# EAGLE design BIBOX Tern  (EAGLE 6.4)
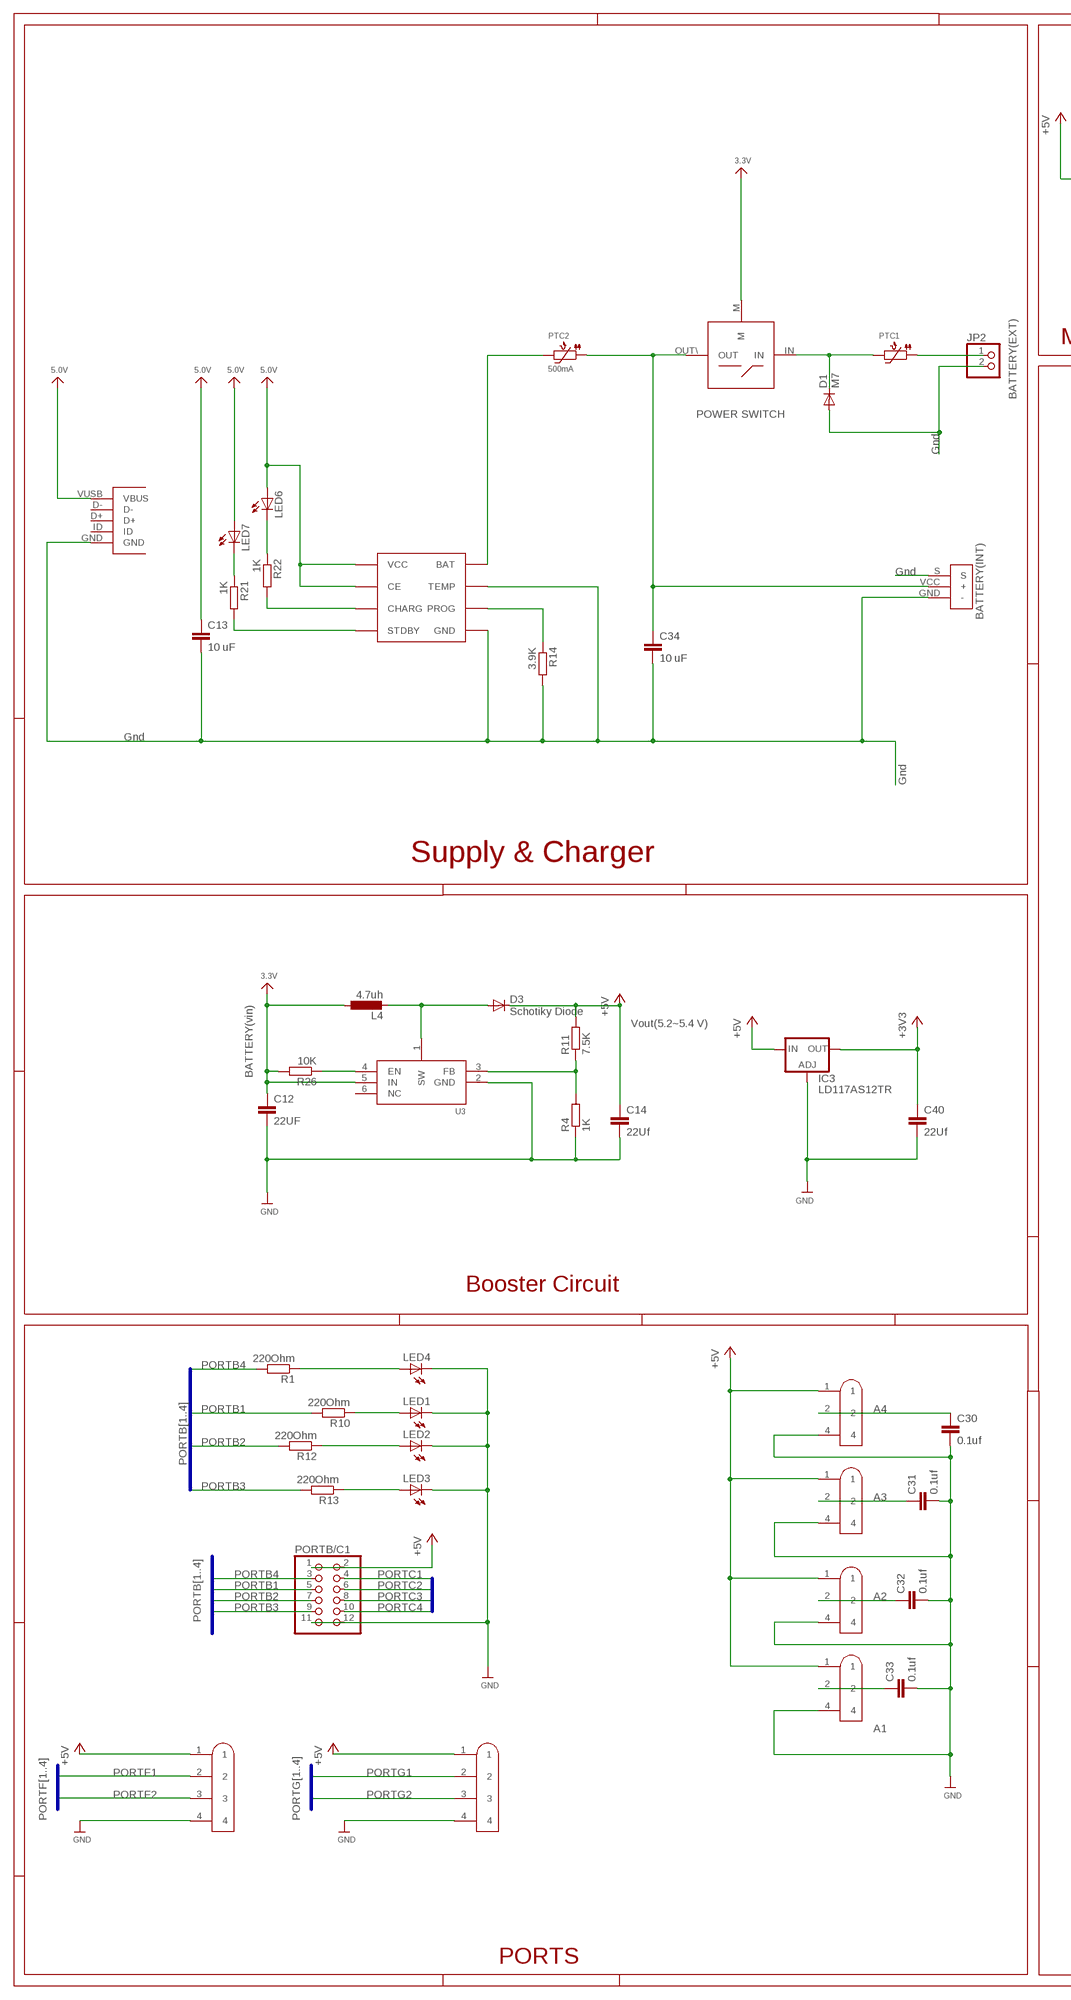
[diagram p0: schematic, sheet 1, part 1 of 2]
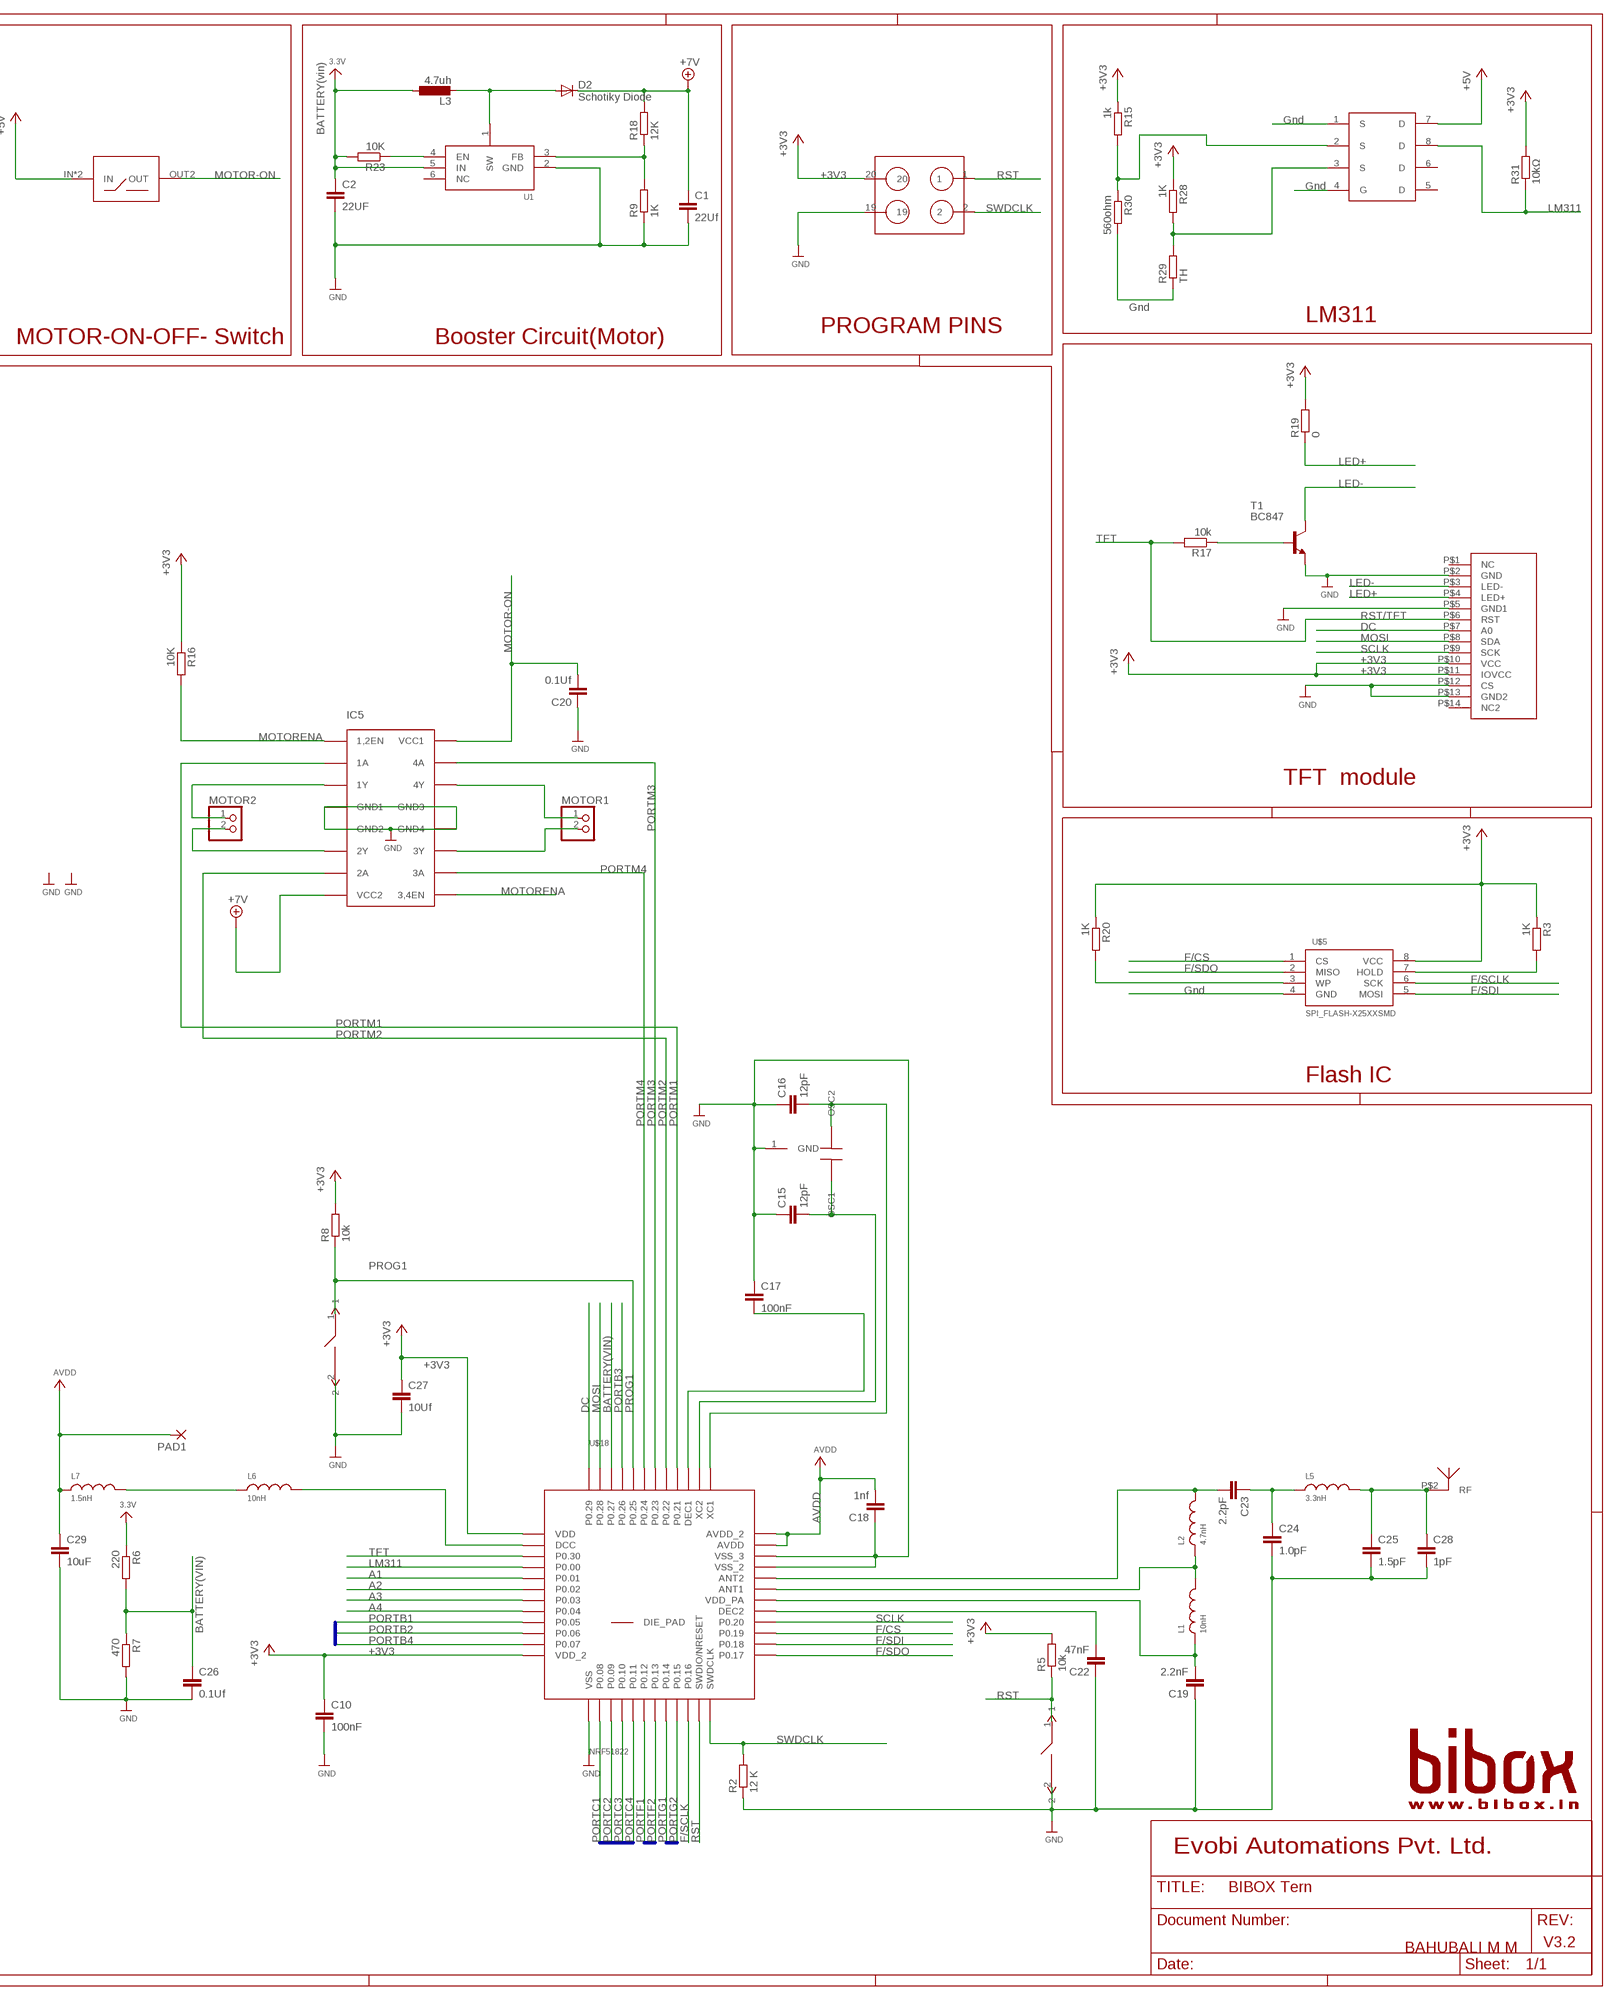
[diagram p1: schematic, sheet 1, part 2 of 2]

## Parts
BATTERY  BS  [BS]
C1  22Uf  C-EUC0603  [C0603]
C2  22UF  C-EUC0603  [C0603]
C10  100nF  C-EUC0603  [C0603]
C12  22UF  C-EUC0603  [C0603]
C13  10 uF  C-EUC0603  [C0603]
C14  22Uf  C-EUC0603  [C0603]
C15  12pF  C-EUC0603  [C0603]
C16  12pF  C-EUC0603  [C0603]
C17  100nF  C-EUC0603  [C0603]
C18  1nf  C-EUC0603  [C0603]
C19  2.2nF  C-EUC0603  [C0603]
C20  0.1Uf  C-EUC0603  [C0603]
C22  47nF  C-EUC0603  [C0603]
C23  2.2pF  C-EUC0603  [C0603]
C24  1.0pF  C-EUC0603  [C0603]
C25  1.5pF  C-EUC0603  [C0603]
C26  0.1Uf  C-EUC0603  [C0603]
C27  10Uf  C-EUC0603  [C0603]
C28  1pF  C-EUC0603  [C0603]
C29  10uF  C-EUC0603  [C0603]
C30  0.1uf  C-EUC0603  [C0603]
C31  0.1uf  C-EUC0603  [C0603]
C32  0.1uf  C-EUC0603  [C0603]
C33  0.1uf  C-EUC0603  [C0603]
C34  10 uF  C-EUC0603  [C0603]
C40  22Uf  C-EUC0603  [C0603]
D1  M7  DIODESMA  [SMA-DIODE]
D2  Schotiky Diode  DIODESMA  [SMA-DIODE]
D3  Schotiky Diode  DIODESMA  [SMA-DIODE]
IC2  LT1173CS8  [SOIC8]
IC3  LD117AS12TR  [SOT223]
IC5  L293D  [DIL16]
JP2  PINHD-1X2  [1X02]
L1  10nH  INDUCTOR0603  [0603]
L2  4.7nH  INDUCTOR0603  [0603]
L3  4.7uh  L-EUWE-TPC  [POWER-CHOKE_WE-TPC]
L4  4.7uh  L-EUWE-TPC  [POWER-CHOKE_WE-TPC]
L5  3.3nH  INDUCTOR0603  [0603]
L6  10nH  INDUCTOR0603  [0603]
L7  1.5nH  INDUCTOR0603  [0603]
LED1  LEDCHIP-LED0805  [CHIP-LED0805]
LED2  LEDCHIP-LED0805  [CHIP-LED0805]
LED3  LEDCHIP-LED0805  [CHIP-LED0805]
LED4  LEDCHIP-LED0805  [CHIP-LED0805]
LED6  LEDCHIP-LED0805  [CHIP-LED0805]
LED7  LEDCHIP-LED0805  [CHIP-LED0805]
MOTOR1  PINHD-1X2  [1X02]
MOTOR2  PINHD-1X2  [1X02]
PAD1  SMD2  [SMD1,27-2,54]
PORTB/C1  PINHD-2X6  [2X06]
PTC1  PTC1206  [1206@1]
PTC2  500mA  PTC1206  [1206]
R1  220Ohm  R-EU_R0603  [R0603]
R2  12 K  R-EU_R0603  [R0603]
R3  1K  R-EU_R0603  [R0603]
R4  1K  R-EU_R0603  [R0603]
R5  10k  R-EU_R0603  [R0603]
R6  220  R-EU_R0603  [R0603]
R7  470  R-EU_R0603  [R0603]
R8  10k  R-EU_R0603  [R0603]
R9  1K  R-EU_R0603  [R0603]
R10  220Ohm  R-EU_R0603  [R0603]
R11  7.5K  R-EU_R0603  [R0603]
R12  220Ohm  R-EU_R0603  [R0603]
R13  220Ohm  R-EU_R0603  [R0603]
R14  3.9K  R-EU_R0603  [R0603]
R15  1k  R-EU_R0603  [R0603]
R16  10K  R-EU_R0603  [R0603]
R17  10k  R-EU_R0603  [R0603]
R18  12K  R-EU_R0603  [R0603]
R19  0  R-EU_R0603  [R0603]
R20  1K  R-EU_R0603  [R0603]
R21  1K  R-EU_R0603  [R0603]
R22  1K  R-EU_R0603  [R0603]
R23  10K  R-EU_R0603  [R0603]
R26  10K  R-EU_R0603  [R0603]
R28  1K  R-EU_R0603  [R0603]
R29  TH  R-EU_M1206  [M1206]
R30  560ohm  R-EU_R0603  [R0603]
R31  10kΩ  R-EU_R0603  [R0603]
RST  NANOSMD\  [NANOSMD]
T1  BC847  [SOT23]
U1  MIC5320  [SOT23-6]
U3  MIC5320  [SOT23-6]
U$1  USBMICRO  [USBMICRO]
U$2  NDS8434  [SO08]
U$4  CRYSTAL8MHZ  [8MHZ]
U$5  SPI_FLASH-X25XXSMD  [SO08]
U$6  10X2  [10X2]
U$8  SWITCH  [3PINSWITCH@1]
U$9  SWITCH  [3PINSWITCH]
U$18  NRF51822  [QFN48]
U$19  3.5MM-JACK  [3.5MM-JACK]
U$20  3.5MM-JACK  [3.5MM-JACK]
U$26  LCDDISPLAY1CHAINA  [LCDDISPLAY1]
U$27  NANOSMD\  [NANOSMD]
U$28  3.5MM-JACK  [3.5MM-JACK]
U$32  3.5MM-JACK  [3.5MM-JACK]
U$34  3.5MM-JACK  [3.5MM-JACK]
U$36  3.5MM-JACK  [3.5MM-JACK]
U$40  WTBT  [BTWT]

## Nets
3.3V: C2.1 C12.1 L3.1 L4.1 R6.1 R23.2 R26.2 U1.5(IN) U3.5(IN) U$9.M
5.0V: C13.1 IC2.CE IC2.VCC LED6.A LED7.A U$1.VUSB(VBUS)
+3V3: C10.1 C27.1 C40.1 IC3.4(OUT) R3.1 R5.2 R8.2 R15.1 R16.1 R19.2 R20.1 R28.1 R31.2 U$5.8(VCC) U$6.20 U$18.1(VDD) U$18.12(VDD_2) U$26.P$10(VCC) U$26.P$11(IOVCC)
+5V: C14.1 D3.C IC3.3(IN) PORTB/C1.1 PORTB/C1.2 R11.2 U$2.7(D) U$8.IN U$8.OUT1(IN) U$19.1 U$20.1 U$28.1 U$32.1 U$34.1 U$36.1
+7V: C1.1 D2.C IC5.8(VCC2) R18.2
A1: C33.1 U$18.5(P0.01) U$34.2
A2: C32.1 U$18.6(P0.02) U$36.2
A3: C31.1 U$18.7(P0.03) U$32.2
A4: C30.1 U$18.8(P0.04) U$28.2
AVDD: C18.2 C29.1 L7.1 PAD1.1(P) U$18.35(AVDD) U$18.36(AVDD_2)
BATTERY(VIN): C26.1 R6.2 R7.1 U$18.46(P0.27)
DC: U$18.48(P0.29) U$26.P$7(A0)
F/CS: U$5.1(CS) U$18.27(P0.19)
F/SCLK: U$5.6(SCK) U$18.22(P0.16)
F/SDI: U$5.5(MOSI) U$18.26(P0.18)
F/SDO: U$5.2(MISO) U$18.25(P0.17)
LED+: R19.1 U$26.P$4(LED+)
LED-: T1.3(C) U$26.P$3(LED-)
LM311: R31.1 U$2.8(D) U$18.4(P0.00)
MOSI: U$18.47(P0.28) U$26.P$8(SDA)
MOTOR-ON: C20.2 IC5.16(VCC1) U$8.OUT2(OUT)
MOTORENA: IC5.1(1,2EN) IC5.9(3,4EN) R16.2
N$1: R3.2 U$5.7(HOLD)
N$2: D2.A L3.2 U1.1(SW)
N$4: JP2.1 PTC1.1
N$5: R20.2 U$5.3(WP)
N$8: C17.2 U$18.39(DEC1)
N$9: R9.2 R18.1 U1.3(FB)
N$10: R23.1 U1.4(EN)
N$12: LED3.A R13.1
N$13: LED2.A R12.1
N$14: C16.2 U$4.OSC2 U$18.37(XC1)
N$15: D3.A L4.2 U3.1(SW)
N$16: LED1.A R10.1
N$17: C23.2 L2.2 U$18.32(ANT2)
N$18: L1.2 L2.1 U$18.31(ANT1)
N$19: R4.2 R11.1 U3.3(FB)
N$20: C23.1 C24.1 L5.1
N$21: C25.1 C28.1 L5.2 U$40.P$2(RF)
N$22: IC5.3(1Y) MOTOR2.1
N$23: C19.2 L1.1 U$18.30(VDD_PA)
N$24: C15.2 U$4.OSC1 U$18.38(XC2)
N$25: C22.2 U$18.29(DEC2)
N$26: L6.2 U$18.2(DCC)
N$27: L6.1 L7.2
N$28: IC5.6(2Y) MOTOR2.2
N$29: LED4.A R1.1
N$30: R17.1 T1.1(B)
N$32: IC5.11(3Y) MOTOR1.2
N$35: IC5.14(4Y) MOTOR1.1
N$36: BATTERY.VCC(+) C34.1 PTC2.1 U$9.OUT\(OUT)
N$37: R26.1 U3.4(EN)
N$38: BATTERY.GND(-) BATTERY.S C1.2 C2.2 C10.2 C12.2 C13.2 C14.2 C15.1 C16.1 C17.1 C18.1 C19.1 C20.1 C22.1 C24.2 C25.2 C26.2 C27.2 C28.2 C29.2 C30.2 C31.2 C32.2 C33.2 C34.2 C40.2 D1.A IC2.GND IC2.TEMP IC3.1(ADJ) IC5.4(GND1) IC5.5(GND2) IC5.12(GND4) IC5.13(GND3) JP2.2 LED1.C LED2.C LED3.C LED4.C PORTB/C1.11 PORTB/C1.12 R2.1 R4.1 R7.2 R9.1 R14.2 R29.1 R30.2 RST.2 T1.2(E) U1.2(GND) U3.2(GND) U$1.GND U$2.1(S) U$2.4(G) U$4.1(GND) U$5.4(GND) U$6.19 U$18.13(VSS) U$18.33(VSS_2) U$18.34(VSS_3) U$19.4 U$20.4 U$26.P$2(GND) U$26.P$5(GND1) U$26.P$12(CS) U$26.P$13(GND2) U$27.2 U$28.4 U$32.4 U$34.4 U$36.4 ; supply symbol labelled GND
N$39: R28.2 R29.2 U$2.3(S)
N$41: IC2.BAT PTC2.2
N$42: R15.2 R30.1 U$2.2(S)
N$43: D1.C PTC1.2 U$9.IN
N$44: IC2.STDBY R21.2
N$45: IC2.PROG R14.1
N$47: LED6.C R22.1
N$48: IC2.CHRG(CHARG) R22.2
N$49: LED7.C R21.1
PORTB1: PORTB/C1.5 R10.2 U$18.9(P0.05)
PORTB2: PORTB/C1.7 R12.2 U$18.10(P0.06)
PORTB3: PORTB/C1.9 R13.2 U$18.45(P0.26)
PORTB4: PORTB/C1.3 R1.2 U$18.11(P0.07)
PORTC1: PORTB/C1.4 U$18.14(P0.08)
PORTC2: PORTB/C1.6 U$18.15(P0.09)
PORTC3: PORTB/C1.8 U$18.16(P0.10)
PORTC4: PORTB/C1.10 U$18.17(P0.11)
PORTF1: U$18.18(P0.12) U$20.2
PORTF2: U$18.19(P0.13) U$20.3
PORTG1: U$18.20(P0.14) U$19.2
PORTG2: U$18.21(P0.15) U$19.3
PORTM1: IC5.2(1A) U$18.40(P0.21)
PORTM2: IC5.7(2A) U$18.41(P0.22)
PORTM3: IC5.15(4A) U$18.42(P0.23)
PORTM4: IC5.10(3A) U$18.43(P0.24)
PROG1: R8.1 U$18.44(P0.25) U$27.1
RST: R5.1 RST.1 U$6.1 U$18.23(SWDIO/NRESET)
SCLK: U$18.28(P0.20) U$26.P$9(SCK)
SWDCLK: R2.2 U$6.2 U$18.24(SWDCLK)
TFT: R17.2 U$18.3(P0.30) U$26.P$6(RST)
Unconnected: U1.6(NC) U3.6(NC) U$1.D+ U$1.D- U$1.ID U$2.5(D) U$2.6(D) U$18.GND(DIE_PAD) U$26.P$1(NC) U$26.P$14(NC2)

## Buses
PORTC[1..4]
PORTG[1..4]
PORTB[1..4]
PORTF[1..4]

## Notes on the sheet
- Gnd
- BATTERY(vin)
- Gnd
- Gnd
- LM311
- PROGRAM PINS
- MOTOR-ON-OFF- Switch | Booster Circuit(Motor)
- BATTERY(EXT)
- POWER SWITCH
- Gnd
- Gnd
- BATTERY(INT) | RST/TFT
- Gnd
- Gnd | TFT  module
- Supply & Charger
- Gnd
- BATTERY(vin)
- Vout(5.2~5.4 V)
- Flash IC
- Booster Circuit
- Evobi Automations Pvt. Ltd.
- V3.2
- BAHUBALI M M
- PORTS

## Library data of the parts
BATTERY = BERG STRIP 0.635 mm:BS
C1 C2 C10 C12-C20 C22-C34 C40 = rcl:C-EU: CAPACITOR, European symbol
D1-D3 = SparkFun:DIODE: Diode These are standard reverse protection diodes and small signal diodes. SMA package can handle up to about 1A. SOD-323 can handle about 200mA. What the SOD-323 package when ordering, there are some mfgs out there that are 5-pin packages.
IC2 = ltc_swr:LT1173: LT1173 - Micropower DC/DC Converter Adjustable and Fixed 5V, 12V Operates at Supply Voltages From 2.0V to 30V Consumes Only 110µA Supply Current Works in Step-Up or Step-Down Mode Only Three External Components Required Low Battery Detector Comparator On-Chip User-Adjustable Current Limit Internal 1A Power Switch Fixed or Adjustable Output Voltage Versions Space Saving 8-Pin MiniDIP or SO8 Package
IC3 = v-reg:LD117A?*: Low drop fixed and adjustable positive voltage regulators 1 A Source: http://www.st.com/stonline/products/literature/ds/7194/ld1117axx.pdf
IC5 = sgs-thom:L293D
JP2 MOTOR1 MOTOR2 = pinhead:PINHD-1X2: PIN HEADER
L1 L2 L5-L7 = new:INDUCTOR: Inductors 0603: 10nH Ceramic Inductor - microwire antenna/RF (Digikey: 712-1434-2-ND) 0805: 560nH Ceramic Inductor - RF (Digikey: 553-1047-1-ND) 1007 (2518 Metric) SMT: 10µH 10% 250mOhm 820mA 1007 Inductor (Digikey: 587-2189-1-ND) 22µH 10% 500mOhm 580mA 1007 Inductor (Digikey: 587-2190-1-ND) 47µH 10% 950mOhm 420mA 1007 Inductor (Digikey: 587-2191-1-ND) 47µH 5% 100mOhm 1A 1008 Inductor (Digikey: 732-1816-1-ND) 6.0x6.0mm: 4.7µH 20% 3.8A 27mOhm Inductor (Digikey: 445-6538-2-ND)
L3 L4 = rcl edited:L-EU: INDUCTOR, European symbol
LED1-LED4 LED6 LED7 = led:LED: LED OSRAM: - CHIPLED LG R971, LG N971, LY N971, LG Q971, LY Q971, LO R971, LY R971 LH N974, LH R974 LS Q976, LO Q976, LY Q976 LO Q996 - Hyper CHIPLED LW Q18S LB Q993, LB Q99A, LB R99A - SideLED LS A670, LO A670, LY A670, LG A670, LP A670 LB A673, LV A673, LT A673, LW A673 LH A674 LY A675 LS A676, LA A676, LO A676, LY A676, LW A676 LS A679, LY A679, LG A679 - Hyper Micro SIDELED® LS Y876, LA Y876, LO Y876, LY Y876 LT Y87S - SmartLED LW L88C, LW L88S LB L89C, LB L89S, LG L890 LS L89K, LO L89K, LY L89K LS L896, LA L896, LO L896, LY L896 - TOPLED LS T670, LO T670, LY T670, LG T670, LP T670 LSG T670, LSP T670, LSY T670, LOP T670, LYG T670 LG T671, LOG T671, LSG T671 LB T673, LV T673, LT T673, LW T673 LH T674 LS T676, LA T676, LO T676, LY T676, LB T676, LH T676, LSB T676, LW T676 LB T67C, LV T67C, LT T67C, LS T67K, LO T67K, LY T67K, LW E67C LS E67B, LA E67B, LO E67B, LY E67B, LB E67C, LV E67C, LT E67C LW T67C LS T679, LY T679, LG T679 LS T770, LO T770, LY T770, LG T770, LP T770 LB T773, LV T773, LT T773, LW T773 LH T774 LS E675, LA E675, LY E675, LS T675 LS T776, LA T776, LO T776, LY T776, LB T776 LHGB T686 LT T68C, LB T68C - Hyper Mini TOPLED® LB M676 - Mini TOPLED Santana® LG M470 LS M47K, LO M47K, LY M47K Source: http://www.osram.convergy.de LUXEON: - LUMILED® LXK2-PW12-R00, LXK2-PW12-S00, LXK2-PW14-U00, LXK2-PW14-V00 LXK2-PM12-R00, LXK2-PM12-S00, LXK2-PM14-U00 LXK2-PE12-Q00, LXK2-PE12-R00, LXK2-PE12-S00, LXK2-PE14-T00, LXK2-PE14-U00 LXK2-PB12-K00, LXK2-PB12-L00, LXK2-PB12-M00, LXK2-PB14-N00, LXK2-PB14-P00, LXK2-PB14-Q00 LXK2-PR12-L00, LXK2-PR12-M00, LXK2-PR14-Q00, LXK2-PR14-R00 LXK2-PD12-Q00, LXK2-PD12-R00, LXK2-PD12-S00 LXK2-PH12-R00, LXK2-PH12-S00 LXK2-PL12-P00, LXK2-PL12-Q00, LXK2-PL12-R00 Source: www.luxeon.com KINGBRIGHT: KA-3528ASYC Source: www.kingbright.com
PAD1 = wirepad:SMD2: SMD PAD
PORTB/C1 = pinhead:PINHD-2X6: PIN HEADER
PTC1 = new:PTC: PTC (Resettable Fuse) 1206 Package 250mA PTC (16V Max, Time-to-Trip: 0.08s) - Digikey: F2110CT-ND 1210 Package 100mA PTC (30V Max, Time-to-Trip: 0.6s) - Digikey: MF-USMF010-2CT-ND 1812 Package 750mA PTC (24V Max, Time-to-Trip: 0.2s) - Digikey: MF-MSMF075/24-2CT-ND
PTC2 = new1:PTC: PTC (Resettable Fuse) 1206 Package 250mA PTC (16V Max, Time-to-Trip: 0.08s) - Digikey: F2110CT-ND 1210 Package 100mA PTC (30V Max, Time-to-Trip: 0.6s) - Digikey: MF-USMF010-2CT-ND 1812 Package 750mA PTC (24V Max, Time-to-Trip: 0.2s) - Digikey: MF-MSMF075/24-2CT-ND
R1-R23 R26 R28-R31 = rcl:R-EU_: RESISTOR, European symbol
RST U$27 = NANO DST Switch:NANOSMD\
T1 = transistor:BC847: NPN TRANSISTOR
U1 U3 = new:MIC5320: MIC5320 - Dual 150mA ULDO Linear Regulator Ultra-low 35mV dropout at 150mA, 2.3-5.5V Input 3.3V/1.8V SOT23-6 (Digikey: 576-1658-1-ND) 3.3V/1.5V SOT23-6 (Digikey: 576-3483-1-ND)
U$1 = USB micro female - through hole:USBMICRO
U$2 = SparkFun-DiscreteSemi:NDS8434: 8-SOIC NMOSFET
U$4 = CRYSTAL16 Mhz:CRYSTAL8MHZ
U$5 = SparkFun-DigitalIC:SPI_FLASH-X25XX: 8pin SPI Flash series x25xx. Works with devices like W25X32 and BR25L32
U$6 = NANO BERGSTRIP 2x2:10X2
U$8 = ploul Switch. for nano bulb:SWITCH
U$9 = ploul Switch:SWITCH
U$18 = NordicSemi:NRF51822: Bluetooth 4.0 Low Energy/2.4Ghz NORDIC SEMICONDUCTOR
U$19 U$20 = 3.5mm jack(4 pole):3.5MM-JACK
U$26 = LCD Display Z144SN005(14 Pins):LCDDISPLAY1CHAINA
U$28 U$32 U$34 U$36 = 3.5mm jack(3 pole):3.5MM-JACK
U$40 = NRF WT-BT-ATENNA -1:WTBT

## Board
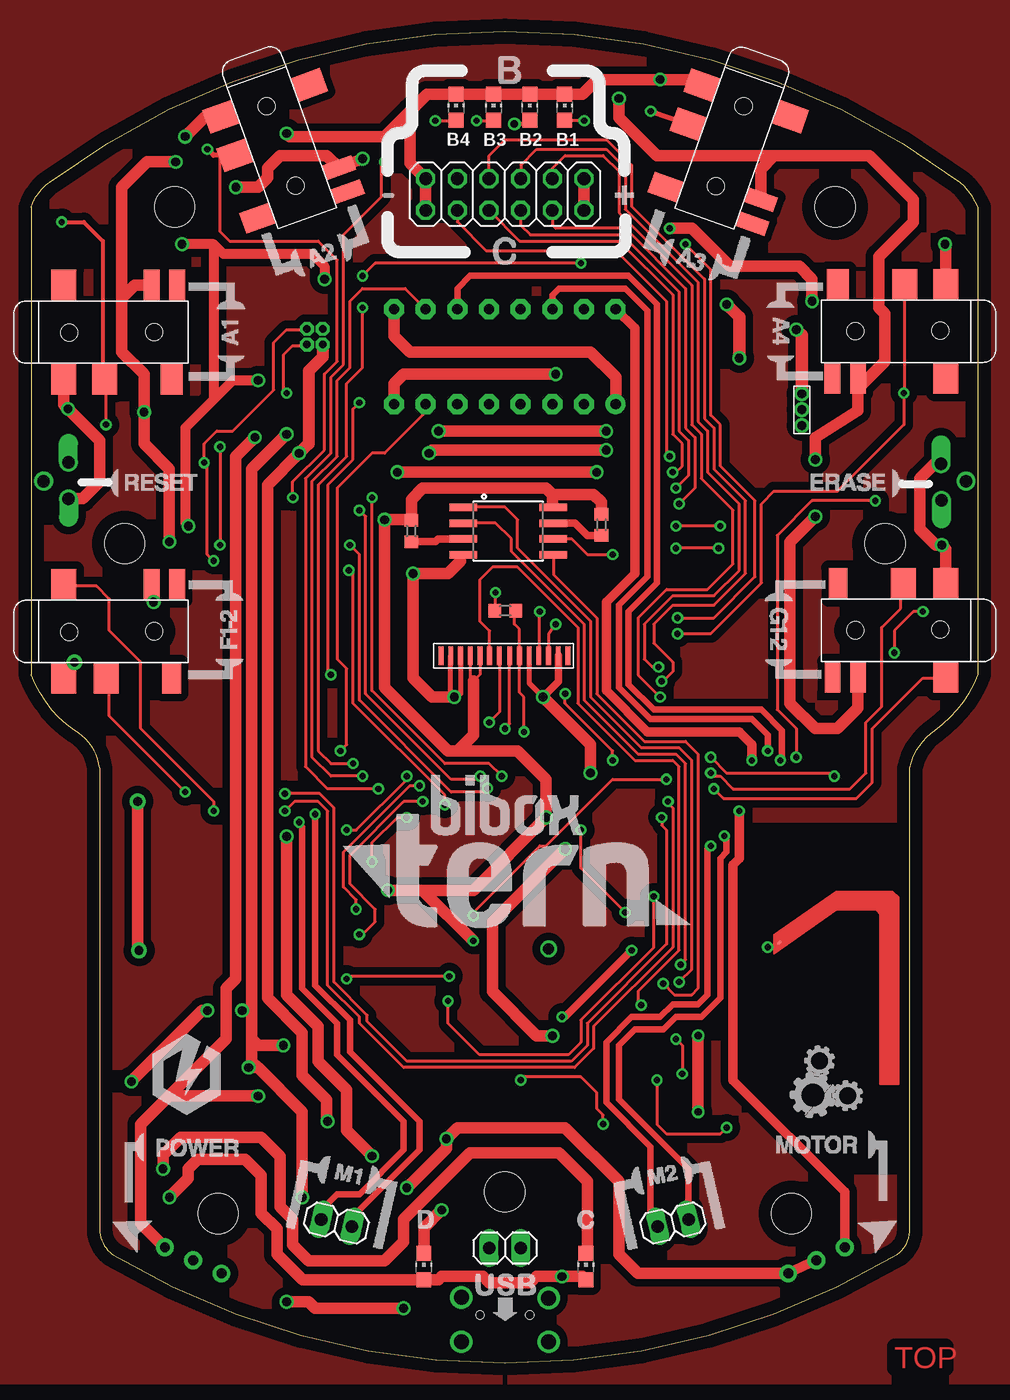
[diagram p2: board, top side]
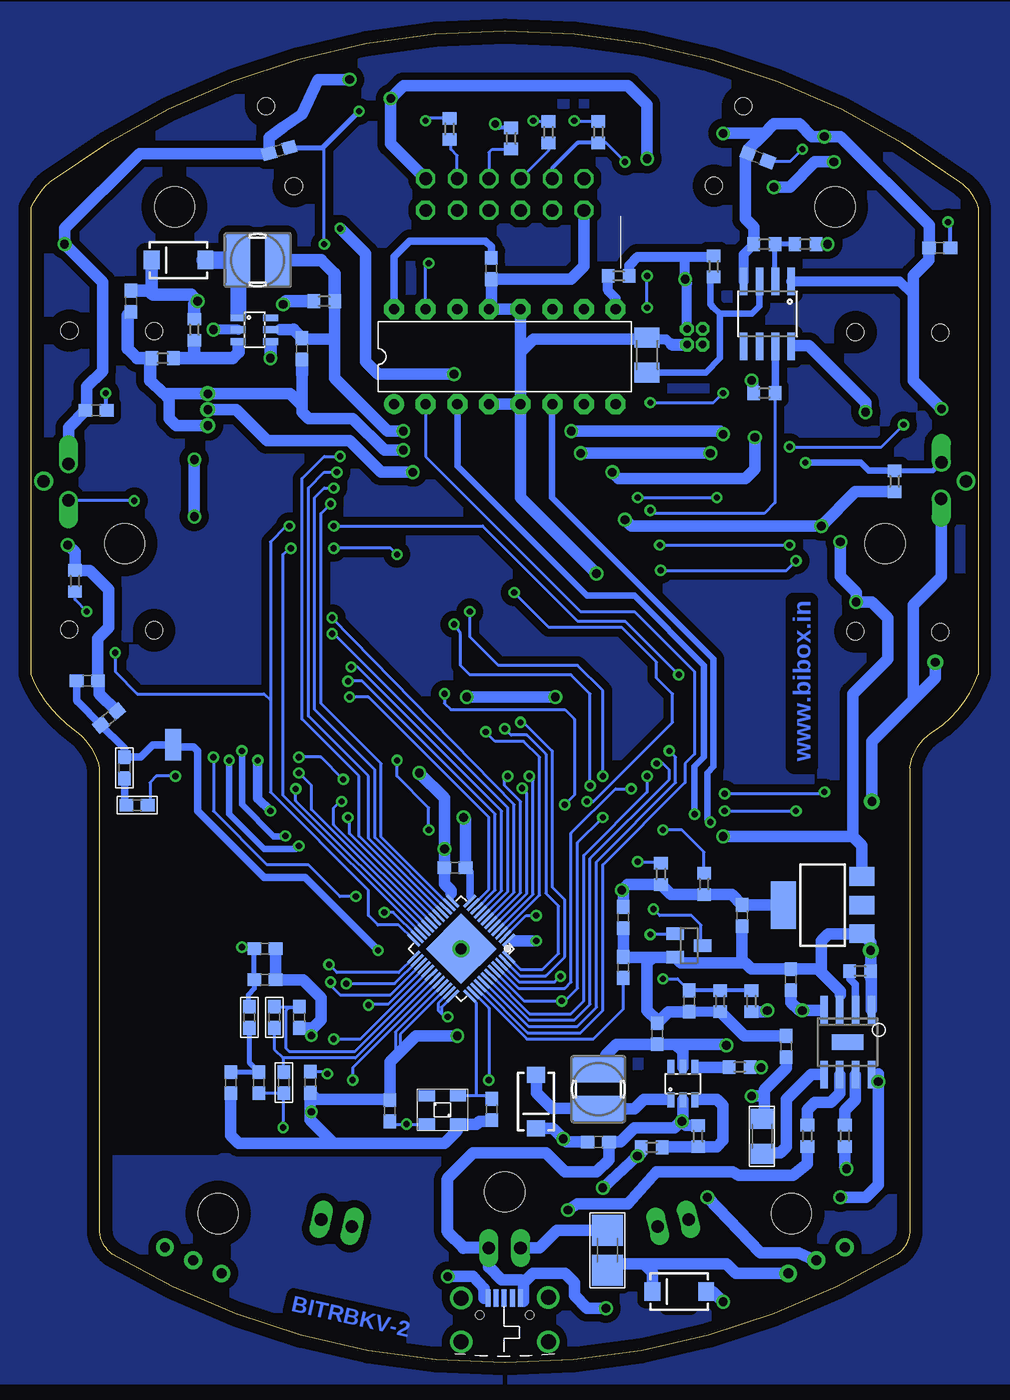
[diagram p3: board, bottom side, seen from below]

Size 76 x 106.82 mm. Coordinates in mm from the lower left corner, seen from the top.
Outline: 6.5,8.72 arc62 69.5,8.72
Outline: 5.5,10.72 arc53 6.5,8.72
Outline: 69.5,8.72 arc53 70.5,10.72
Outline: 69.5,8.72 arc53 70.5,10.72
Outline: 70.5,10.72 70.5,47.72 arc-44 72.5,50.72 arc33 76,55.22 76,92.72 arc21 74.5,94.72 arc73 1.5,94.72 arc37 0,92.72 0,55.22 arc35 3.5,50.72 arc-53 5.5,47.72 5.5,10.72
Outline: 6.5,8.72 arc62 69.5,8.72
Outline: 5.5,10.72 arc53 6.5,8.72
Outline: 69.5,8.72 arc53 70.5,10.72
Outline: 69.5,8.72 arc53 70.5,10.72
Copper layers (1*16): Top 0.035mm / dielectric 1.5mm / Bottom 0.035mm
Design rules "default *": minimum track width 10mil, minimum drill 24mil, track to track 8mil, track to pad 8mil, pad to pad 8mil, via to via 8mil, smd to smd 8mil, copper to edge 40mil, drill to drill 8mil, minimum pad ring 10mil, minimum via ring 8mil, stop-mask expansion 4mil, vias tented up to drill 30mil, thermal gap 10mil
Holes 3.2 mm at 15,11.97 61,11.97 64.5,92.72 11.5,92.72 38,13.72 7.5,65.72 68.5,65.72
tRestrict: area 48.3,8.4 to 49.6,10.1; area 50.8,13 to 51.5,15.6; area 46.1,17.4 to 47.9,18.2; area 47.3,15.8 to 48.7,17.2; area 63.5,12.2 to 64.4,13.6; area 63.5,9.4 to 64.1,11.7; area 44.7,23 to 45.5,24; area 41.4,8.1 to 43.2,14.8; area 37,1.1 to 39.1,4.9; area 25.3,2 to 31.2,3.1; area 31,1.2 to 32.8,5.1; area 34.1,11.2 to 35.8,14; 128 more areas
bRestrict: area 53.2,40.4 to 53.9,40.9; area 51.8,45.6 to 52.9,46.6; area 52.6,44.3 to 52.8,45.6; area 66.8,42.7 to 67.3,43.3; area 48.4,18.7 to 51.2,19.9; area 42.6,20 to 43.5,20.4; area 40,20.3 to 40.8,20.7; area 32,16.3 to 32.9,16.7; area 37.7,10.6 to 38.3,11.2; area 36.5,0.6 to 39.6,3.9; area 31.7,8.3 to 33.6,9.5; area 33.7,8.2 to 34.4,8.8; 179 more areas

### Footprints (pad centres in the part's own frame; a part is rotated, then mirrored left to right if it is on the bottom)
BS = drill 0.7 pad 1: GND 1.272,0; S -1.27,0; VCC -0.002,0
C0603 = smd 1.1 x 1: 1 -0.85,0; 2 0.85,0
SMA-DIODE = smd 1.27 x 1.47: A -2.15,0; C 2.15,0
SOIC8 = smd 0.6 x 2.2: BAT 1.905,2.6; CE -1.905,2.6; CHRG -0.635,2.6; GND 0.635,-2.6; PROG -0.635,-2.6; STDBY 0.635,2.6; TEMP -1.905,-2.6; VCC 1.905,-2.6 | smd 2.54 x 1.27: P$1 0,0
SOT223 = smd 1.5 x 2: 1 -2.3,-3.15; 2 0,-3.15; 3 2.3,-3.15 | smd 3.8 x 2: 4 0,3.15
DIL16 = drill 0.813 pad 1.6: 1 -8.89,-3.81 | drill 0.813 pad 1.6 octagon: 2 -6.35,-3.81; 3 -3.81,-3.81; 4 -1.27,-3.81; 5 1.27,-3.81; 6 3.81,-3.81; 7 6.35,-3.81; 8 8.89,-3.81; 9 8.89,3.81; 10 6.35,3.81; 11 3.81,3.81; 12 1.27,3.81; 13 -1.27,3.81; 14 -3.81,3.81; 15 -6.35,3.81; 16 -8.89,3.81
1X02 = drill 1.016 long: 1 -1.27,0; 2 1.27,0
0603 = smd 1.1 x 1: 1 -0.85,0; 2 0.85,0
POWER-CHOKE_WE-TPC = smd 4.3 x 2: 1 0,1.55; 2 0,-1.55
CHIP-LED0805 = smd 1.2 x 1.2: A 0,-1.05; C 0,1.05
SMD1,27-2,54 = smd 1.27 x 2.54: 1 0,0
2X06 = drill 1.016 octagon: 1 -6.35,-1.27; 2 -6.35,1.27; 3 -3.81,-1.27; 4 -3.81,1.27; 5 -1.27,-1.27; 6 -1.27,1.27; 7 1.27,-1.27; 8 1.27,1.27; 9 3.81,-1.27; 10 3.81,1.27; 11 6.35,-1.27; 12 6.35,1.27
1206 = smd 2.5 x 2.5: 1 -1.6,0; 2 1.6,0
1206' = smd 1.6 x 1.8: 1 -1.4,0; 2 1.4,0
R0603 = smd 1 x 1.1: 1 -0.85,0; 2 0.85,0
M1206 = smd 1.6 x 2: 1 -1.4,0; 2 1.4,0
NANOSMD = drill 1 pad 1.422 offset: 1 -1.519,-0.026; 2 1.401,-0.006 | drill 1: P$3 0,-2
SOT23 = smd 1 x 1.4: 1 -0.95,-1.1; 2 0.95,-1.1; 3 0,1.1
SOT23-6 = smd 0.55 x 1.2: 1 -0.95,-1.3; 2 0,-1.3; 3 0.95,-1.3; 4 0.95,1.3; 5 0,1.3; 6 -0.95,1.3
USBMICRO = smd 0.4 x 1.4: D+ 0.04,-3.66; D- 0.69,-3.66; GND -1.26,-3.66; ID -0.61,-3.66; VUSB 1.34,-3.66 | drill 1.2: P$1 3.5,-3.65; P$7 3.5,-0.15; P$9 -3.5,-3.7; P$10 -3.5,-0.15 | hole 0.65: 2,-2.3; -2,-2.3
SO08 = smd 0.61 x 2.21: 1 -1.905,-2.616; 2 -0.635,-2.616; 3 0.635,-2.616; 4 1.905,-2.616; 5 1.905,2.616; 6 0.635,2.616; 7 -1.905,2.616; 8 -0.635,2.616
8MHZ = smd 1.3 x 0.9: 1 -1.235,1.075; 2 1.255,-1.205; OSC1 1.265,1.075; OSC2 -1.235,-1.215
SO08' = smd 0.61 x 2.21: 1 -1.905,-3.346; 2 -0.635,-3.346; 3 0.635,-3.346; 4 1.905,-3.346; 5 1.905,3.886; 6 0.635,3.886; 7 -0.635,3.886; 8 -1.905,3.886
10X2 = drill 0.6 pad 0.8 octagon: 1 -0.64,0.57; 2 -0.64,-0.68; 19 0.61,-0.68; 20 0.61,0.57
3PINSWITCH = drill 0.8 pad 1.422: IN 0,0; OUT1 2.5,0; OUT2 -2.5,0
3PINSWITCH' = drill 0.8 pad 1.422: IN -2.5,0; M 0,0; OUT\ 2.5,0
QFN48 = smd 1.3 x 0.226: 1 -3.17,2.2; 2 -3.17,1.8; 3 -3.17,1.4; 4 -3.17,1; 5 -3.17,0.6; 6 -3.17,0.2; 7 -3.17,-0.2; 8 -3.17,-0.6; 9 -3.17,-1; 10 -3.17,-1.4; 11 -3.17,-1.8; 12 -3.17,-2.2; 25 3.17,-2.2; 26 3.17,-1.8; 27 3.17,-1.4; 28 3.17,-1; 29 3.17,-0.6; 30 3.17,-0.2; 31 3.17,0.2; 32 3.17,0.6; 33 3.17,1; 34 3.17,1.4; 35 3.17,1.8; 36 3.17,2.2 | smd 0.226 x 1.3: 13 -2.2,-3.17; 14 -1.8,-3.17; 15 -1.4,-3.17; 16 -1,-3.17; 17 -0.6,-3.17; 18 -0.2,-3.17; 19 0.2,-3.17; 20 0.6,-3.17; 21 1,-3.17; 22 1.4,-3.17; 23 1.8,-3.17; 24 2.2,-3.17; 37 2.2,3.17; 38 1.8,3.17; 39 1.4,3.17; 40 1,3.17; 41 0.6,3.17; 42 0.2,3.17; 43 -0.2,3.17; 44 -0.6,3.17; 45 -1,3.17; 46 -1.4,3.17; 47 -1.8,3.17; 48 -2.2,3.17 | smd 4 x 4: GND 0,0
3.5MM-JACK = smd 1.25 x 2.5: 1 4.065,3.71; NOC 6.115,3.71 | smd 2 x 2.5: 2 0.415,-3.79; 3 -2.985,3.71; 4 -2.985,-3.79 | smd 1.5 x 2.5: NC 5.665,-3.79 | hole 1.35: -2.535,-0.09; 4.265,-0.04
LCDDISPLAY1 = smd 0.38 x 1.5: P$1 -5.07,0; P$2 -4.29,0; P$3 -3.51,0; P$4 -2.73,0; P$5 -1.95,0; P$6 -1.17,0; P$7 -0.39,0; P$8 0.44,0; P$9 1.22,0; P$10 2,0; P$11 2.78,0; P$12 3.56,0; P$13 4.34,0; P$14 5.12,0
3.5MM-JACK' = smd 1.25 x 2.5: 1 4.065,3.71; NOC 6.115,3.71 | smd 2 x 2.5: 2 0.315,-3.79; 3 -2.985,3.71; 4 -2.985,-3.79 | smd 1.75 x 2.5: NC 5.665,-3.79 | hole 1.35: -2.535,-0.09; 4.265,-0.04
BTWT = smd 0.406 x 0.203 rotated 304.9: P$2 2.61,-0.06

### Placement (x,y rotation side)
BATTERY  61.83,76.46 270 top
C1  67.98,85.16 270 bottom
C2  54.27,81.35 270 bottom
C10  28.5,35.72 270 bottom
C12  25.77,26.41 90 bottom
C13  15.05,30.74 90 bottom
C14  30.5,17.72 0 bottom
C15  47.22,20.22 270 bottom
C16  39.03,20.33 90 bottom
C17  28.5,31.72 270 bottom
C18  71.5,54.72 180 bottom
C19  54.5,27.72 90 bottom
C20  39.07,87.79 90 bottom
C22  53.61,22.5 90 bottom
C23  57.74,22.49 270 bottom
C24  59.99,22.49 270 bottom
C25  57.25,30.72 0 bottom
C26  23.22,29.03 270 bottom
C27  42,39.72 180 bottom
C28  57.25,33.22 0 bottom
C29  69.75,51.72 40.3 bottom
C30  70.78,76.41 180 bottom
C31  56.1,97.25 196.4 bottom
C32  17.71,96.71 158.6 bottom
C33  3.11,89.45 180 bottom
C34  15.42,25.38 90 bottom
C40  18.96,35.89 270 bottom
D1  24,5.72 180 bottom
D2  64.17,88.46 180 bottom
D3  35.5,20.96 270 bottom
IC2  10.5,25.72 180 bottom
IC3  12.5,36.72 90 bottom
IC5  38,80.72 0 bottom
JP2  38.01,9.22 0 top
L1  56.5,27.72 270 bottom
L2  55.74,22.49 270 bottom
L3  57.82,88.46 270 bottom
L4  30.5,21.96 0 bottom
L5  58.5,27.72 90 bottom
L6  67.5,44.72 0 bottom
L7  68.5,47.72 270 bottom
LED1  40,100.72 0 top
LED2  37.1,100.72 0 top
LED3  34.09,100.72 0 top
LED4  42.8,100.72 0 top
LED6  44.5,7.72 0 top
LED7  31.5,7.72 0 top
MOTOR1  51.5,11.22 193 top
MOTOR2  24.5,11.22 167 top
PAD1  64.62,49.58 180 bottom
PORTB/C1  38,93.72 180 top
PTC1  [1206]  29.76,9.03 270 bottom
PTC2  500mA  [1206']  17.37,18.19 270 bottom
R1  42.44,98.98 270 bottom
R2  72.48,62.72 270 bottom
R3  45.75,67.23 270 top
R4  22.5,18.2 270 bottom
R5  6.74,70.72 270 bottom
R6  18.22,29.03 90 bottom
R7  20.72,29.03 270 bottom
R8  25.48,39.22 270 bottom
R9  65.44,80.59 0 bottom
R10  37.5,98.22 270 bottom
R11  26.21,17.3 180 bottom
R12  34.5,98.72 270 bottom
R13  30.5,98.72 270 bottom
R14  9.5,31.43 0 bottom
R15  13.88,89.73 180 bottom
R16  28.87,87.19 180 bottom
R17  38.02,60.34 0 top
R18  62.9,82.88 90 bottom
R19  22.01,38.43 270 bottom
R20  30.5,66.72 270 top
R21  13.74,18.22 90 bottom
R22  10.72,18.22 90 bottom
R23  52.49,85.16 0 bottom
R26  19.16,23.74 0 bottom
R28  21.25,87.96 270 bottom
R29  26.58,80.84 270 bottom
R30  17.18,89.73 180 bottom
R31  17.18,77.8 180 bottom
RST  3,70.72 270 top
T1  23.23,33.49 270 bottom
U1  58.08,82.88 270 bottom
U3  23.71,22.39 0 bottom
U$1  38.01,1.55 180 bottom
U$2  16.93,84.15 180 bottom
U$4  43,20.22 180 bottom
U$5  SPI_FLASH-X25XXSMD  [SO08']  38,66.72 270 top
U$6  22.77,82.37 0 top
U$8  SWITCH  [3PINSWITCH]  63,8.22 204.8 top
U$9  SWITCH  [3PINSWITCH']  13,8.22 155.2 top
U$18  41.5,33.22 225 bottom
U$19  70.4,58.72 180 top
U$20  5.6,58.72 0 top
U$26  38,56.72 180 top
U$27  73,70.72 90 top
U$28  3.5MM-JACK  [3.5MM-JACK']  70.39,82.71 180 top
U$32  3.5MM-JACK  [3.5MM-JACK']  56.39,98.39 250.4 top
U$34  3.5MM-JACK  [3.5MM-JACK']  5.6,82.72 0 top
U$36  3.5MM-JACK  [3.5MM-JACK']  19.82,98.44 289.8 top
U$40  60.1,36.32 270 top

### Tracks (layer width: path | path; a pad name or v marks a point on that pad's centre or on a via)
3.3V  (via drill 0.7)
  Top 0.914: v21.76,13.28 21.76,20.14 18.2,23.69 | 17.69,25.98 17.69,28.27 | 17.69,28.27 17.69,71.7 v20.49,74.49 | v20.23,25.47 18.2,25.47 17.69,25.98 | v16.93,28.27 17.69,28.27 | 17.69,25.98 17.69,24.2 18.2,23.69 | v17.44,23.69 18.2,23.69 | v32.68,74.75 v46.14,74.75
  Bottom 0.406: U1.5 56.05,82.88
  Bottom 0.914: 56.05,82.88 54.94,82.88 | U$9.M 13.14,8.22 14.44,8.84 17.49,8.84 v21.76,13.28 | L4.1 29.88,24.13 29.88,24.71 29.03,25.56 C12.1 24.3,25.56 | 24.3,25.56 20.32,25.56 v20.23,25.47 | U3.5 23.71,24.98 24.3,25.56 | R6.1 17.02,28.18 v16.93,28.27 | R26.2 18.27,23.69 v17.44,23.69 | v20.49,74.49 20.74,74.75 v32.68,74.75 | v46.14,74.75 47.41,74.75 51.64,78.98 51.64,82.11 | 51.64,82.11 R23.2 | C2.1 54.18,82.11 51.64,82.11
  Bottom 1.016: 54.94,82.88 C2.1 | L3.1 52.74,88.46 51.64,87.36 R23.2
5.0V  (via drill 0.7)
  Top 0.813: LED6.A
  Top 0.914: LED6.A 44.24,6.93 v42.58,6.93 40.55,6.93 40.04,6.42 36.74,6.42 36.23,6.93 32.93,6.93 32.68,6.67 LED7.A 21.76,6.67 19.72,8.71 19.72,10.74 18.45,12.01 18.45,15.06 17.18,16.33 13.37,16.33 12.61,15.57 12.61,14.8 v11.09,13.28 | v8.04,22.57 13.74,28.27 v14.14,28.27
  Bottom 0.254: U$1.VUSB 39.48,5.21 39.66,5.2
  Bottom 0.305: 39.48,5.21 39.34,5.21 39.66,5.2 | IC2.VCC 12.55,28.32 12.61,28.27 12.87,28.27 | IC2.CE 8.1,23.12 8.04,23.19
  Bottom 0.914: v42.58,6.93 40.55,6.93 39.66,5.97 39.66,5.2 | 12.87,28.27 v14.14,28.27 14.39,28.27 15.05,28.93 C13.1 | 8.04,23.19 v8.04,22.57 8.04,14.3 9.06,13.28 v11.09,13.28
+3V3  (via drill 0.5, 0.7)
  Top 0.254: U$26.P$11 35.22,54.93 35.34,54.81 | U$26.P$10 36,55.21 35.47,54.68
  Top 0.406: U$5.8 41.89,69.1 41.82,68.91 | 35.47,54.68 35.34,54.81
  Top 0.813: 14.64,89.73 15.41,88.97 22.52,88.97 23.53,87.96 v23.53,86.94 | 14.64,89.73 14.64,77.29 | 14.64,77.29 12.36,75 12.36,67.38 v12.61,67.13 | v18.2,78.81 16.17,78.81 14.64,77.29 | 14.64,89.73 v12.1,89.73
  Top 0.914: 41.82,68.91 41.82,69.41 41.95,69.54 | 41.95,69.54 42.08,69.67 45.12,69.67 45.75,69.04 R3.1 | 41.95,69.54 41.31,70.18 31.41,70.18 30.5,69.27 R20.1 30.44,67.64 v28.36,67.64 28.36,54.17 33.44,49.09 34.2,49.09 | v35.47,33.85 31.41,37.92 | 31.41,37.92 v28.61,37.92 | 31.41,37.92 35.47,37.92 v41.31,43.76 41.31,46.81 39.03,49.09 34.2,49.09 | 35.47,54.68 35.47,50.36 34.2,49.09
  Bottom 0.254: U$18.12 40.81,37.4 40.81,37.41 | U$18.1 37.65,33.85 37.25,33.85
  Bottom 0.508: 28.11,87.28 R16.1
  Bottom 0.61: 40.81,37.41 40.81,39.38 C27.1
  Bottom 0.813: R28.1 21.34,88.72 23.28,88.72 | R16.1 28.02,88.04 27.34,88.72 23.28,88.72 | U$6.20 23.38,86.58 23.53,86.74 v23.53,86.94 23.53,88.46 23.28,88.72 | R15.1 v12.1,89.73 | R31.2 18.03,78.65 v18.2,78.81
  Bottom 0.914: 15.75,38.01 15.66,37.92 IC3.4 | IC3.4 | IC3.4 C40.1 19.8,37.58 R19.2 24.69,37.58 R8.2 28.17,38.37 v28.61,37.92 28.5,37.8 C10.1 | 37.25,33.85 v35.47,33.85 | v41.31,43.76 41.15,43.6 C27.1 | R5.2 9.87,69.87 v12.61,67.13 27.85,67.13 v28.36,67.64
+5V  (via drill 0.7)
  Top 0.406: U$28.1 66.21,79 66.21,79.12
  Top 0.61: 58.04,93.8 U$32.1
  Top 0.813: 66.46,54.89 U$19.1 66.41,54.94 | U$8.IN U$8.OUT1
  Top 0.914: v30.14,14.04 33.31,17.22 v33.31,17.98 34.2,18.87 42.84,18.87 47.16,14.55 47.16,8.71 48.69,7.18 U$8.OUT1 | v20.49,42.24 20.49,29.54 23.03,27 23.03,24.2 25.31,21.92 25.31,18.64 v27.36,16.6 | U$20.1 9.66,61.19 v9.82,61.03 | 7.28,85.42 7.28,81.1 9.06,79.32 v9.06,76.27 9.06,73.73 11.09,71.7 v11.09,65.86 | 7.28,85.42 8.29,86.43 U$34.1 | U$32.1 58.53,95.77 59.6,96.85 | 59.6,96.85 67.22,96.85 70.78,93.29 70.78,91.51 67.98,88.72 67.98,84.65 68.49,84.15 68.49,80.34 66.46,78.3 66.33,78.3 | 59.6,96.85 50.2,96.85 47.16,99.89 v47.16,101.42 | PORTB/C1.1 PORTB/C1.2 | v11.6,96.34 9.31,96.34 7.28,94.31 7.28,85.42 | v26.58,96.59 U$36.1 23.72,96.85 19.98,96.85 18.96,95.83 18.96,95.07 18.2,94.31 v16.42,94.31 | U$19.1 66.34,52.53 64.68,50.87 62.9,50.87 60.87,52.9 60.87,65.86 v62.9,67.89 | v62.9,72.46 62.9,74.24 66.33,76.39 66.33,78.3 | 66.33,78.3 U$28.1
  Bottom 0.61: U$2.7 14.72,81.53 14.64,81.61
  Bottom 0.914: C14.1 33.06,17.72 v33.31,17.98 34.15,18.81 D3.C | IC3.3 9.35,41.51 10.07,42.24 | 10.07,42.24 v20.49,42.24 | v27.36,16.6 27.06,16.87 R11.2 27.06,16.89 v27.36,16.6 | v27.36,16.6 v30.14,14.04 | v16.42,94.31 15.15,94.31 13.12,96.34 v11.6,96.34 | 10.07,42.24 10.07,53.67 7.28,56.46 7.28,59.76 8.55,61.03 v9.82,61.03 9.82,61.79 11.09,63.06 v11.09,65.86 | v26.58,96.59 26.58,100.91 28.11,102.43 46.14,102.43 v47.16,101.42 47.16,97.8 PORTB/C1.1 | v62.9,67.89 v62.9,72.46 | 14.64,81.61 13.63,81.61 9.06,77.03 v9.06,76.27
+7V  (via drill 0.5, 0.7)
  Top 0.914: IC5.8 29.11,78.55 29.88,79.32 v42.08,79.32 | v51.22,91 53,91 56.05,87.96 61.63,87.96 62.65,86.94 v62.65,85.16
  Bottom 0.914: v42.08,79.32 48.17,79.32 49.19,80.34 49.19,88.97 v51.22,91
  Bottom 1.016: C1.1 66.55,86.01 66.32,85.79 | D2.C 66.32,85.79 | 66.32,85.79 66.21,85.67 63.16,85.67 v62.65,85.16 62.9,84.91 R18.2
A1  (via drill 0.5)
  Top 0.254: v6.01,75.26 6.01,78.84 U$34.2 | v36.61,46.1 36.31,45.79 33.69,45.79 26.33,53.16 26.33,64.84 v25.57,65.6 | v15.15,73.48 v15.15,65.6
  Top 0.305: v2.45,91.51 4.23,91.51 5.75,89.99 5.75,79.1 U$34.2
  Bottom 0.254: v15.15,73.48 7.79,73.48 v6.01,75.26 | v25.57,65.6 v15.15,65.6 | U$18.5 36.23,37.64 36.23,45.72 v36.61,46.1
  Bottom 0.305: C33.1 2.26,91.32 v2.45,91.51
A2  (via drill 0.5)
  Top 0.254: v37.76,47.06 36.74,48.08 33.19,48.08 27.34,53.92 v27.34,69.41 | 15.15,96.86 15.15,90.75 15.91,89.99 23.03,89.99 24.55,88.46 24.55,80.34 23.53,79.32 23.53,73.22 20.99,70.68 v20.99,69.41
  Top 0.406: U$36.2 15.15,96.86 14.63,96.86 v14.14,97.35
  Bottom 0.254: C32.1 15.09,96.4 v14.14,97.35 | U$18.6 36.74,37.7 36.74,45.03 38.01,46.3 38.01,46.81 v37.76,47.06 | v27.34,69.41 v20.99,69.41
A3  (via drill 0.5)
  Top 0.254: v51.85,59.76 54.78,59.76 58.08,63.06 58.08,69.16 55.28,71.95 55.28,75.26 54.52,76.02 54.52,87.7 v52.49,89.73
  Top 0.406: v49.7,100.4 U$32.2
  Bottom 0.254: U$18.7 37.25,37.76 37.25,44.78 v51.85,59.76 | v52.49,89.73 52.49,97.61 52.11,97.99
  Bottom 0.406: C31.1 52.6,97.49 52.11,97.99 v49.7,100.4
A4  (via drill 0.5)
  Top 0.254: v51.85,58.49 54.52,58.49 58.59,62.56 58.59,68.91 59.6,69.92 64.68,69.92 70.02,75.26 v70.02,77.8 70.08,77.86 U$28.2
  Bottom 0.254: U$18.8 37.76,37.82 37.76,44.52 51.73,58.49 v51.85,58.49
  Bottom 0.305: v70.02,77.8 70.02,76.49 C30.1
AVDD  (via drill 0.5)
  Top 0.61: v48.17,33.09 42.84,27.76 v42.58,27.76
  Bottom 0.254: U$18.35 43.35,28.83 43.35,28.27 43.09,28.01 | 43.09,28.01 42.84,27.76 v42.58,27.76 | U$18.36 43.09,28.52 43.09,28.01
  Bottom 0.61: C18.2 72.35,53.23 arc-45 72.28,53.05 C29.1 68.57,49.35 arc45 68.5,49.17 L7.1 arc45 68.47,48.59 67.22,48.59 66.3,49.51 arc45 66.12,49.58 PAD1.1 64.43,49.4 62.95,49.4 62.65,49.09 62.65,44.27 57.32,38.93 54.01,38.93 v48.17,33.09
BATTERY(VIN)  (via drill 0.5)
  Top 0.254: v33.54,31.01 25.52,31.01 v25.31,30.81
  Bottom 0.254: U$18.46 36.85,30.55 34,30.55 v33.54,31.01 | v25.31,30.81 24.15,30.81 C26.1
  Bottom 0.305: R6.2 R7.1 C26.1
DC  (via drill 0.5)
  Top 0.254: U$26.P$7 38.39,51.25 v38.01,50.87
  Bottom 0.254: U$18.48 36.73,31.57 34.96,31.57 33.69,32.84 33.69,36.65 34.71,37.66 34.71,48.84 36.23,50.36 37.5,50.36 v38.01,50.87
F/CS  (via drill 0.5)
  Top 0.254: U$5.1 34.68,68.65 38.01,68.65 39.03,67.64 39.03,65.35 44.87,59.51 44.87,53.41 48.93,49.35 51.98,49.35 53,48.33 53,31.57 v51.98,30.55
  Bottom 0.254: U$18.27 47.17,29.54 51.22,29.54 51.98,30.3 v51.98,30.55
F/SCLK  (via drill 0.5)
  Top 0.254: U$5.6 43.37,66.09 44.62,64.84 v46.65,64.84 | v55.16,65.35 v51.73,65.35
  Bottom 0.254: U$18.22 55.79,45.54 55.79,64.84 55.28,65.35 v55.16,65.35 | v46.65,64.84 47.16,65.35 v51.73,65.35
F/SDI  (via drill 0.5)
  Top 0.254: 42.08,64.63 U$5.5 41.91,64.84 41.91,63.23 45.38,59.76 45.38,53.67 49.19,49.86 52.49,49.86 53.51,48.84 53.51,30.04 53,29.54 51.6,29.54 v50.71,30.43
  Bottom 0.254: U$18.26 46.84,30.43 v50.71,30.43
F/SDO  (via drill 0.5)
  Top 0.254: U$5.2 34.68,67.38 37.25,67.38 38.52,66.11 38.52,65.1 44.36,59.25 44.36,53.16 48.68,48.84 51.73,48.84 52.49,48.08 52.49,32.33 v52.11,31.95
  Bottom 0.254: U$18.25 46.52,31.31 51.47,31.31 v52.11,31.95
LED+  (via drill 0.5)
  Top 0.254: v25.31,42.74 26.07,42.74 30.14,46.81 v30.14,47.06 | v40.81,60.27 40.73,60.19 U$26.P$4
  Bottom 0.254: R19.1 22.01,40.97 23.79,42.74 v25.31,42.74 | v40.81,60.27 40.81,58.24 38.52,55.95 32.17,55.95 30.14,53.92 v30.14,47.06
LED-  (via drill 0.5)
  Top 0.254: v26.07,36.39 26.07,37.16 25.06,38.17 25.06,40.97 30.39,46.3 v31.15,46.3 | v42.08,59.25 41.51,58.43 U$26.P$3
  Bottom 0.254: T1.3 22.26,33.62 22.26,35.12 23.03,35.89 25.57,35.89 v26.07,36.39 | v42.08,59.25 41.57,58.49 41.57,55.95 40.81,55.19 32.68,55.19 31.15,53.67 v31.15,46.3
LM311  (via drill 0.5)
  Top 0.254: v36.03,47.06 35.78,46.81 33.69,46.81 26.84,53.67 26.84,67.89 v26.33,68.4
  Bottom 0.254: U$18.4 35.73,37.58 35.73,46.76 v36.03,47.06 | R31.1 16.33,68.99 17.18,68.14 26.07,68.14 v26.33,68.4
  Bottom 0.61: U$2.8 16.3,77.84 R31.1
MOSI  (via drill 0.5)
  Top 0.254: U$26.P$8 37.56,52.2 v36.74,51.38
  Bottom 0.254: U$18.47 36.79,31.06 34.71,31.06 33.19,32.58 33.19,37.16 34.2,38.17 34.2,49.09 36.49,51.38 v36.74,51.38
MOTOR-ON  (via drill 0.5)
  Top 0.762: v57.82,48.33 57.82,49.6 56.81,50.62 49.44,50.62 46.14,53.92 46.14,61.03 48.43,63.32 48.43,83 IC5.16 | U$8.OUT2 65.27,13.71 56.3,22.68 56.3,39.95 56.81,40.46 v56.81,44.27
  Bottom 0.61: C20.2 39.07,89.52 39.54,89.99 45.63,89.99 46.89,88.73 IC5.16
  Bottom 0.762: v57.82,48.33 57.82,45.28 v56.81,44.27
MOTORENA
  Top 0.914: IC5.1 46.9,76.93 46.9,79.07 44.87,81.1 30.39,81.1 29.11,82.38 IC5.9
  Bottom 0.813: IC5.9 29.11,85.4 29.72,86.01 R16.2
N$1
  Top 0.61: U$5.7 43.62,67.36 44.62,66.37 45.74,66.37 R3.2
N$2
  Bottom 0.254: U1.1 59.38,84.17 59.37,84.17
  Bottom 1.27: 59.37,84.17 L3.2
  Bottom 1.422: D2.A L3.2
N$4
  Bottom 0.914: PTC1.1 33.81,10.63 35.22,9.22 JP2.1
N$5
  Top 0.61: U$5.3 32.66,66.09 32.44,65.87 R20.2 30.52,65.86
N$6
  pour Bottom (isolate 0.61): -2.5,-1.28 78.5,-1.28 78.5,108.72 -2.5,108.72
N$7
  pour Top (isolate 0.61): -2.5,109.72 79.5,109.72 79.5,-1.28 -2.5,-1.28
N$8
  Bottom 0.254: U$18.39 36.24,25.98 30.9,25.98 28.5,28.38 C17.2
N$9
  Bottom 0.406: U1.3 59.38,81.64 59.35,81.61
  Bottom 1.016: 59.35,81.61 59.35,81.1 59.86,80.59 62.65,80.59 | 62.65,80.59 R9.2 | R18.1 62.9,80.84 62.65,80.59
N$10  (via drill 0.7)
  Top 1.016: v56.81,80.59 56.81,83.89 v55.79,84.91
  Bottom 0.406: U1.4 56.81,81.9 56.81,81.61
  Bottom 0.914: v55.79,84.91 55.7,85
  Bottom 1.016: 56.81,81.61 v56.81,80.59 | 55.7,85 55.54,85.16 R23.1
N$12  (via drill 0.5)
  Top 0.254: v32.42,99.64 34.06,99.64 LED3.A
  Bottom 0.254: R13.1 32.36,99.57 v32.42,99.64
N$13  (via drill 0.5)
  Top 0.254: v35.73,99.64 37.07,99.64 LED2.A
  Bottom 0.254: R12.1 35.41,99.57 v35.73,99.64
N$14
  Bottom 0.254: C16.2 39.29,21.44 40.3,21.44 | 40.3,21.44 U$4.OSC2 | U$18.37 40.3,28.91 40.3,21.44
N$15
  Bottom 0.305: U3.1 25,21.09 25.06,21.15
  Bottom 0.914: D3.A 35.47,23.08 35.47,21.66 34.22,20.41 L4.2 30.48,20.39 27.6,20.39 26.84,21.15 25.06,21.15
N$16  (via drill 0.6)
  Top 0.305: v38.77,99.39 39.71,99.39 LED1.A
  Bottom 0.305: R10.1 38.46,99.07 v38.77,99.39
N$17  (via drill 0.5)
  Top 0.254: v50.2,22.68 50.2,19.12 50.97,18.36 55.28,18.36 v55.79,18.87
  Bottom 0.254: U$18.32 50.2,23.67 v50.2,22.68 | C23.2 L2.2 55.79,21.58 v55.79,18.87
N$18
  Bottom 0.254: U$18.31 49.98,24.46 55.79,24.46 | L1.2 56.5,25.16 55.79,24.46 | 55.79,24.46 55.79,23.39 L2.1
N$19
  Bottom 0.305: U3.3 22.45,21.09 22.39,21.15
  Bottom 0.914: 22.39,21.15 20.99,21.15 20.49,20.65 20.49,17.85 20.99,17.34 R4.2 25.31,17.35 R11.1
N$20
  Bottom 0.406: C24.1 C23.1 58.5,24.1 L5.1
N$21  (via drill 0.5)
  Top 0.406: v59.09,33.35 59.67,33.35 U$40.P$2
  Bottom 0.406: v59.09,33.35 58.97,33.22 C28.1 C25.1 58.1,30.03 58.59,29.54 58.59,28.66 L5.2
N$22  (via drill 0.5)
  Top 0.508: MOTOR2.1 25.74,11.67 31.15,17.09 31.15,19.38 25.57,24.96 25.57,27.5 22.77,30.3 v22.77,44.01
  Bottom 0.508: IC5.3 41.81,71.94 31.41,61.54 27.6,61.54 22.01,55.95 22.01,48.59 22.77,47.82 v22.77,44.01
N$23
  Bottom 0.254: U$18.30 50.04,24.96 55.28,24.96 55.54,25.22 55.54,28.27 55.28,28.52 54.55,28.52 C19.2 L1.1
N$24  (via drill 0.5)
  Top 0.254: v45.89,19.15 45.89,19.88 45.38,20.39 45.38,21.66 44.11,22.93 39.54,22.93 v39.28,22.68
  Bottom 0.254: C15.2 46.99,19.15 v45.89,19.15 U$4.OSC1 | U$18.38 39.28,28.46 v39.28,22.68
N$25  (via drill 0.5)
  Top 0.254: v52.24,23.19 52.24,25.47 v51.73,25.98
  Bottom 0.254: U$18.29 49.59,25.98 v51.73,25.98 | v52.24,23.19 52.4,23.35 C22.2
N$26  (via drill 0.5)
  Top 0.254: v54.52,48.59 55.79,47.32 64.17,47.32 v64.43,47.06 | v35.47,35.89 35.47,36.14 40.81,41.47 41.31,41.47 46.65,46.81 v50.97,46.81
  Bottom 0.254: v50.97,46.81 52.74,48.59 v54.52,48.59 | U$18.2 36.29,35.89 v35.47,35.89 | v64.43,47.06 65.95,47.06 66.46,46.55 66.46,44.91 L6.2
N$27
  Bottom 0.61: L7.2 68.5,44.87 L6.1
N$28  (via drill 0.5)
  Top 0.508: MOTOR2.2 23.26,12.25 24.55,13.53 26.33,13.53 29.88,17.09 29.88,19.38 24.55,24.71 24.55,27.25 21.76,30.04 21.76,43 v21.5,43.38
  Bottom 0.508: IC5.6 34.2,76.9 34.2,69.41 21.25,56.46 21.25,47.82 21.76,47.32 21.76,43.63 v21.5,43.38
N$29  (via drill 0.5)
  Top 0.254: LED4.A 44.33,99.67 v44.36,99.64
  Bottom 0.254: R1.1 44.17,99.83 v44.36,99.64
N$30  (via drill 0.5)
  Top 0.254: v26.33,34.36 26.58,34.36 27.6,35.38 27.6,36.39 25.57,38.43 25.57,40.71 29.88,45.03 v31.41,45.03 | R17.1 37.25,60.42 v37.25,61.79
  Bottom 0.254: T1.1 24.4,34.36 v26.33,34.36 | v37.25,61.79 34.46,59 28.61,59 25.82,56.21 25.82,54.94 24.55,53.67 24.55,51.38 30.9,45.03 v31.41,45.03
N$32  (via drill 0.5)
  Top 0.508: IC5.11 34.19,86.17 35.22,87.19 47.92,87.19 50.2,84.91 50.2,62.56 47.92,60.27 47.92,54.43 49.95,52.4 58.59,52.4 60.24,50.75 60.24,48.46 v60.11,48.33 | MOTOR1.2 49.7,11.51 49.7,17.34 46.14,20.9 46.14,25.73 48.17,27.76 50.46,27.76 51.47,28.77 53.51,28.77 54.27,29.54 54.27,41.22 v54.52,41.47
  Bottom 0.508: v54.52,41.47 54.78,41.22 57.32,41.22 60.11,44.01 v60.11,48.33
N$35  (via drill 0.5)
  Top 0.508: IC5.14 41.81,85.66 42.33,86.18 47.66,86.18 49.44,84.4 49.44,63.06 47.16,60.78 47.16,54.17 49.7,51.63 57.82,51.63 59.09,50.36 v59.09,49.09 | MOTOR1.1 52.74,15.57 47.16,21.15 47.16,25.47 48.43,26.74 50.71,26.74 51.73,27.76 53.76,27.76 55.28,29.28 55.28,40.46 55.79,40.97 55.79,42.08 v55.61,42.26
  Bottom 0.508: v59.09,49.09 59.09,44.78 56.55,42.24 55.64,42.24 v55.61,42.26
N$36  (via drill 0.7)
  Top 0.914: U$9.OUT\ 8.8,11.2 8.8,19.12 11.09,21.41 | 11.09,21.41 v18.2,21.41 | 11.09,21.41 15.66,25.98 15.66,30.04 16.42,30.81 16.42,72.72 v17.95,74.24 | v29.38,71.45 v45.38,71.45
  Bottom 0.914: C34.1 15.42,23.68 17.18,21.92 17.18,21.41 | 17.18,21.41 17.18,19.77 PTC2.1 | v18.2,21.41 17.18,21.41 | v29.38,71.45 28.87,70.94 18.71,70.94 17.95,71.7 v17.95,74.24 | v45.38,71.45 47.92,71.45 50.46,73.99 57.06,73.99 59.54,76.47 BATTERY.VCC
N$37
  Bottom 0.305: U3.4 22.52,23.69
  Bottom 0.914: 22.52,23.69 20.05,23.69 R26.1
N$38  (via drill 0.6, 0.7, 0.7 pad 1.27)
  Top 0.254: 34.49,56.72 U$26.P$12 | U$5.4 34.62,64.79 34.4,64.79 34.46,64.73 34.46,64.33
  Top 0.406: U$26.P$13 33.66,53.95 v33.95,53.41 34.45,53.66 U$26.P$12 | U$26.P$5 39.95,54.52 v41.06,53.41
  Top 0.61: U$26.P$2 42.29,54.64 v41.06,53.41
  Top 0.914: U$32.4 53.36,102.94 v50.46,102.94 45.38,102.94 44.21,101.77 LED4.C LED1.C LED2.C LED3.C 31.76,101.77 30.39,100.4 | 30.39,100.4 30.39,96.25 PORTB/C1.11 PORTB/C1.12 | 30.39,100.4 28.36,98.37 20.74,98.37 v20.49,98.62 | U$34.4 2.62,76.87 v2.96,76.53 5.5,73.99 5.5,70.68 4.14,69.32 RST.2 | U$19.4 73.39,65.28 v73.06,65.6 72.56,65.6 71.29,66.87 71.29,70.94 72.56,72.21 72.92,72.21 U$27.2 | v29.88,4.39 22.77,4.39 22.26,4.9 v20.49,4.9 | v8.55,45.03 8.55,33.19 v8.65,33.09 | v3.47,56.21 2.62,55.35 U$20.4 | v23.79,19.38 23.71,19.7 U3.2 21.76,23.05 21.76,26.49 18.96,29.28 18.96,70.43 v21.5,72.97 | v41.82,26.23 40.55,26.23 37,29.79 37,35.38 v42.84,41.22 | v33.95,53.41 32.17,53.41 30.65,54.94 v30.65,63.32 33.44,63.32 34.46,64.33 | U$36.4 13.96,99.97 v12.36,98.37 | v44.87,47.32 44.87,49.6 v41.06,53.41 | v73.32,89.73 73.38,89.68 U$28.4 | v31.92,72.97 32.17,73.22 v46.14,73.22 | v53.51,20.14 v53.51,26.23
  Top 0.965: U$6.19 23.38,80.69 22.26,79.57 22.26,73.73 v21.5,72.97
  Top 1.016: BATTERY.S 61.83,82.42 v61.38,82.88
  Bottom 0.254: 36.65,5.21 36.49,5.37 36.61,4.77 36.51,4.92 | U$18.13 42.19,37.52 42.33,37.66 | U$18.34 46.39,26.35 46.39,24.96 | 42.85,41.46 42.84,41.45 | U$18.33 46.77,26.54 46.77,24.58
  Bottom 0.305: 36.65,5.21 U$1.GND
  Bottom 0.61: R7.2 20.89,28.34 | IC2.GND 11.13,29.49 11.09,29.54
  Bottom 0.813: R7.2 C26.2 | U1.2 v61.38,82.88 | U$2.4 18.84,88.93 R30.2 | U$2.1 6.34,86.76 5.25,85.67 | 24.63,81.69 25.06,82.11 26.45,82.11 R29.1
  Bottom 0.914: C16.1 39.13,19.38 40.04,19.38 40.27,19.15 U$4.1 41.82,19.09 41.82,18.61 42.84,17.6 51.73,17.6 | C26.2 24.86,28.18 C12.2 25.77,27.46 26.58,28.27 26.58,32.03 26.07,32.54 | IC2.TEMP 8.6,30.81 | 8.6,30.81 8.6,31.38 R14.2 v8.65,33.09 | v8.65,33.09 8.65,33.72 IC3.1 12.04,34.42 12.61,33.85 12.61,31.31 | 26.07,32.54 T1.2 23.87,32.08 18.96,32.08 | 26.07,32.54 28.46,32.54 C17.1 C10.2 | 40.55,16.84 34.71,16.84 33.19,15.31 30.65,15.31 29.65,16.31 C14.2 28.74,17.72 27.6,18.87 24.4,18.87 23.71,19.56 U3.2 23.71,19.7 v23.79,19.38 23.46,19.05 R4.1 | PORTB/C1.12 31.65,87.97 32.68,86.94 C20.1 39.07,84.73 IC5.13 IC5.12 36.73,81.1 | v50.46,102.94 53,102.94 54.27,100.15 55.79,99.13 56.91,98.26 C31.2 67.31,97.01 73.32,91 v73.32,89.73 70.27,86.69 70.27,79.57 71.54,78.3 71.54,76.5 C30.2 73.01,75.04 U$27.2 | C29.2 69.13,52.27 70.52,53.67 70.52,54.6 C18.1 70.65,58.11 69.76,59 69.76,62.05 71.29,63.57 R2.1 72.48,65.02 v73.06,65.6 | 42.33,37.66 42.33,37.92 42.84,38.43 42.84,39.71 C27.2 42.84,39.74 v42.84,41.22 42.84,41.45 | 11.09,29.54 11.09,29.79 12.61,31.31 | 12.61,31.31 12.89,31.59 C13.2 18.23,31.59 18.71,32.08 18.96,32.08 | 39.28,7.69 38.27,6.68 36.74,6.68 36.49,6.42 | 36.51,4.92 36.51,6.19 36.49,6.42 | v29.88,4.39 31.41,4.39 32.42,5.41 32.42,6.42 33.19,7.18 35.73,7.18 36.49,6.42 | D1.A 21.31,5.72 v20.49,4.9 | C34.2 18.77,26.23 R7.2 | 5.12,53.29 3.47,54.94 v3.47,56.21 | 5.12,53.29 8.55,49.86 v8.55,45.03 | v8.65,33.09 8.65,30.86 8.6,30.81 | RST.2 2.99,63.03 5.25,60.78 5.25,53.41 5.12,53.29 | 36.73,81.1 IC5.5 | v41.82,26.23 45.12,26.23 46.39,24.96 46.77,24.58 47.22,24.14 C15.1 47.3,21.15 53.11,21.15 C22.1
  Bottom 0.914: C40.2 18.96,32.08 | IC5.5 36.73,69.4 v30.65,63.32 | IC5.5 IC5.4 | v41.06,53.41 v33.95,53.41 | 42.85,41.46 42.85,45.3 v44.87,47.32 | 17.31,98.5 16.42,99.39 14.39,99.39 13.37,98.37 v12.36,98.37 11.09,98.37 3.96,91.24 C33.2 3.98,89.43 3.98,88.46 5.25,87.19 5.25,85.67 5.25,78.81 v2.96,76.53 | 17.31,98.5 18.5,97.31 C32.2 18.71,96.81 18.71,91.77 18.03,91.09 R30.2 | v20.49,98.62 17.44,98.62 17.31,98.5 | 26.45,82.11 35.71,82.11 36.73,81.1 | v21.5,72.97 v31.92,72.97 | v46.14,73.22 47.66,73.22 50.2,75.76 53.76,75.76 54.27,76.27 54.27,76.78 | 54.27,76.78 C2.2 | 54.27,76.78 55.22,77.73 BATTERY.S 65.38,77.73 | 65.38,77.73 66.46,78.81 | BATTERY.GND 64.36,75.19 64.94,75.76 64.94,77.29 65.38,77.73 | C28.2 C25.2 54.19,30.72 52.74,29.28 52.74,27.5 53.37,26.87 | 53.37,26.87 C19.1 | C22.1 53.61,19.48 51.73,17.6 | C24.2 59.99,18.24 59.35,17.6 51.73,17.6 | C22.1 53.61,20.24 v53.51,20.14 | v53.51,26.23 53.51,26.74 53.37,26.87
  Bottom 0.965: 39.28,7.69 JP2.2 41.31,9.22 42.58,10.49 42.58,14.8 40.55,16.84 | 24.63,81.69 U$6.19
  Bottom 1.016: C1.2 68.24,84.06 68.24,81.35 67.48,80.59 R9.1 66.46,80.42 66.46,78.81 | 54.27,79.32 C2.2
N$39
  Bottom 0.508: U$2.3 17.56,84.78 18.2,84.15 20.74,84.15 | R28.2 21.5,86.85 21.5,84.91 21.25,84.65 20.74,84.15 | R29.2 21.89,79.44 20.74,80.59 20.74,84.15
N$40  (via drill 0.89)
  other vias: 41.51,33.21
N$41
  Bottom 0.254: IC2.BAT 12.75,23.12 12.76,23.14
  Bottom 0.914: PTC2.2 17.32,16.84 15.91,16.84 15.41,17.34 15.41,21.15 13.43,23.14 12.76,23.14
N$42
  Bottom 0.406: R15.2 R30.1 16.33,86.8 U$2.2
N$43
  Bottom 0.914: 30.28,7.18 PTC1.2 30,7.95 26.84,7.95 | U$9.IN 19.46,7.18 20.23,7.95 26.84,7.95 | D1.C 26.15,7.26 26.84,7.95
N$44
  Bottom 0.61: 13.63,19.18 R21.2
  Bottom 0.914: IC2.STDBY 11.13,21.62 11.85,20.9 13.12,20.9 13.74,20.28 R21.2
N$45
  Bottom 0.61: IC2.PROG 9.87,30.35 10.33,30.81 10.33,31.41 R14.1
N$47  (via drill 0.7)
  Top 0.914: LED6.C 44.62,8.89 44.62,14.55 42.33,16.84 35.22,16.84 29.88,11.5 29.88,9.72 28.36,8.2 22.26,8.2 20.99,9.47 20.99,11.5 19.98,12.52 19.98,16.58 18.45,18.11 11.99,18.11 10.58,16.69 v10.58,15.57
  Bottom 0.914: R22.1 10.72,15.71 v10.58,15.57
N$48
  Bottom 0.914: IC2.CHRG 9.87,21.11 10.72,20.25 R22.2
N$49  (via drill 0.7)
  Top 0.914: LED7.C 31.5,10.83 v32.93,12.26
  Bottom 0.914: R21.1 13.74,15.96 14.9,15.06 19.22,15.06 19.72,15.31 25.82,15.31 28.11,12.77 32.17,12.77 v32.93,12.26
PORTB1  (via drill 0.5)
  Top 0.254: PORTB/C1.5 39.28,95.01 39.28,96.08 40.55,97.35 46.14,97.35 47.66,95.83 47.66,92.53 53.51,86.69 53.51,75.51 54.27,74.75 54.27,71.45 56.81,68.91 56.81,63.57 54.78,61.54 51.47,61.54 49.19,59.25 49.19,56.46 49.82,55.83 v50.33,55.83
  Bottom 0.254: U$18.9 38.27,37.87 38.27,44.27 49.82,55.83 v50.33,55.83 | PORTB/C1.5 39.28,95.01 39.28,97.1 39.03,97.35 37.52,97.35 R10.2
PORTB2  (via drill 0.5)
  Top 0.254: PORTB/C1.7 36.73,96.83 38.01,98.12 46.14,98.12 48.17,96.08 48.17,92.78 54.01,86.94 54.01,75.76 54.78,75 54.78,71.7 57.32,69.16 57.32,63.32 54.78,60.78 51.47,60.78 49.95,59.25 49.95,57.73 51.47,56.21 51.47,55.44 50.71,54.68 v50.59,54.68
  Bottom 0.254: U$18.10 38.77,37.93 38.77,44.01 49.44,54.68 v50.59,54.68 | 34.5,97.82 34.5,97.22 PORTB/C1.7
  Bottom 0.305: R12.2 34.5,97.82
PORTB3  (via drill 0.5)
  Top 0.254: v27.85,46.05 23.79,46.05 22.01,47.82 22.01,70.94 24.04,72.97 24.04,79.07 25.06,80.08 25.06,90.5 28.11,93.54 28.11,96.08 v28.36,96.34
  Bottom 0.254: U$18.45 36.91,30.04 33.19,30.04 32.68,30.55 32.68,42.49 29.12,46.05 v27.85,46.05 | v28.36,96.34 29.9,97.87 R13.2
  Bottom 0.305: R13.2 32.16,97.87 34.2,95.83 34.2,95.01 PORTB/C1.9
PORTB4  (via drill 0.5)
  Top 0.254: PORTB/C1.3 41.82,95.01 41.82,95.83 42.84,96.85 45.89,96.85 47.16,95.58 47.16,92.27 53,86.43 53,75.26 53.76,74.49 53.76,70.94 56.3,68.4 56.3,64.08 54.27,62.05 50.97,62.05 48.68,59.76 48.68,55.19 v50.46,53.41
  Bottom 0.254: PORTB/C1.3 41.82,95.01 41.82,96.85 42.33,97.35 42.33,98.02 R1.2 | U$18.11 39.28,37.99 39.28,43.76 48.93,53.41 v50.46,53.41
PORTC1  (via drill 0.5)
  Top 0.254: PORTB/C1.4 41.81,91.27 42.08,91 47.66,91 52.49,86.18 52.49,75 53.25,74.24 53.25,70.18 v51.98,68.91
  Bottom 0.254: U$18.14 47.92,42.19 47.92,48.08 52.74,52.9 52.74,68.14 v51.98,68.91
PORTC2  (via drill 0.5)
  Top 0.254: PORTB/C1.6 39.27,91.27 40.04,90.5 47.41,90.5 51.98,85.92 51.98,74.75 52.74,73.99 52.74,71.19 52.49,70.94 v51.73,70.18
  Bottom 0.254: U$18.15 48.43,42.13 48.43,47.57 53.25,52.4 53.25,69.41 52.49,70.18 v51.73,70.18
PORTC3  (via drill 0.5)
  Top 0.254: PORTB/C1.8 39.2,89.99 47.16,89.99 51.47,85.67 51.47,74.49 52.24,73.73 52.24,71.95 51.73,71.45 v51.47,71.45
  Bottom 0.254: U$18.16 48.93,42.07 48.93,47.06 53.76,51.89 53.76,70.18 52.49,71.45 v51.47,71.45
PORTC4  (via drill 0.5)
  Top 0.254: PORTB/C1.10 34.19,91.52 36.49,89.23 46.9,89.23 50.97,85.16 50.97,72.97 v51.22,72.72
  Bottom 0.254: U$18.17 49.7,42.27 49.7,47.06 54.27,51.63 54.27,70.94 52.49,72.72 v51.22,72.72
PORTF1  (via drill 0.5)
  Top 0.254: v50.59,43.76 50.59,43.13 50.97,42.74 50.97,33.6 44.62,27.25 44.62,25.47 43.35,24.2 30.14,24.2 26.96,27.38 26.96,27.89 24.3,30.55 24.3,44.52 23.15,45.67 v20.36,45.67 | v12.36,45.79 6.27,51.88 6.27,54.68 U$20.2
  Bottom 0.254: U$18.18 50.46,42.47 50.46,43.63 v50.59,43.76 | v20.36,45.67 12.48,45.67 v12.36,45.79
PORTF2  (via drill 0.5)
  Top 0.254: U$20.3 2.75,62.3 5.25,62.3 6.26,61.29 6.26,58.75 8.8,56.21 8.8,50.87 14.64,45.03 v14.64,44.27 | v51.09,45.03 51.09,44.9 51.47,44.52 51.47,33.35 45.12,27 45.12,25.22 43.6,23.69 29.88,23.69 26.33,27.25 26.33,27.76 23.79,30.3 23.79,44.27 23.03,45.03 21.12,45.03 v20.36,44.27
  Bottom 0.254: U$18.19 51.73,43.17 51.73,44.52 51.22,45.03 v51.09,45.03 | v20.36,44.27 v14.64,44.27
PORTG1  (via drill 0.5)
  Top 0.254: U$19.2 69.76,62.29 69.76,60.52 68.24,59 68.24,52.65 66.97,51.38 66.97,47.32 65.7,46.05 56.3,46.05 55.28,47.06 54.78,47.06 v54.52,47.32
  Bottom 0.254: U$18.20 53.51,44.38 53.51,46.3 v54.52,47.32
PORTG2  (via drill 0.5)
  Top 0.254: U$19.3 73.31,54.94 71.54,54.94 67.48,50.87 67.48,46.55 66.21,45.28 55.54,45.28 v54.78,46.05
  Bottom 0.254: U$18.21 54.78,45.09 v54.78,46.05
PORTM1
  Bottom 0.254: U$18.40 36.18,26.49 31.92,26.49 30.14,28.27 30.14,39.95 23.53,46.55 23.53,48.08 22.77,48.84 22.77,55.44 27.6,60.27 31.92,60.27 44.35,72.7 IC5.2
PORTM2  (via drill 0.5)
  Top 0.254: IC5.7 31.65,76.26 28.36,72.97 27.34,72.97 24.55,70.18 24.55,56.46 25.31,55.7 25.31,49.6 v24.8,49.09
  Bottom 0.254: U$18.41 36.12,27 32.17,27 30.65,28.52 30.65,40.2 24.3,46.55 24.3,48.59 v24.8,49.09
PORTM3  (via drill 0.5)
  Top 0.254: v25.82,48.08 24.04,48.08 23.03,49.09 23.03,70.43 25.31,72.72 25.31,78.56 26.58,79.83 v26.58,84.65 | v44.11,88.21 27.6,88.21 v26.58,87.19
  Bottom 0.254: U$18.42 36.06,27.5 32.42,27.5 31.15,28.77 31.15,40.46 24.8,46.81 24.8,47.57 25.31,48.08 v25.82,48.08 | v26.58,84.65 v26.58,87.19 | 44.36,84.55 44.36,87.96 v44.11,88.21
  Bottom 0.406: 44.36,84.55 44.35,84.55 IC5.15
PORTM4  (via drill 0.5)
  Top 0.254: v26.58,47.06 24.04,47.06 22.52,48.59 22.52,70.68 24.55,72.72 24.55,78.81 25.57,79.83 25.57,85.16 26.58,86.18 30.01,86.18 IC5.10
  Bottom 0.254: U$18.43 36,28.01 32.68,28.01 31.66,29.03 31.66,40.71 26.58,45.79 v26.58,47.06
PROG1  (via drill 0.5)
  Top 0.254: v67.73,69.16 62.65,69.16 59.86,66.37 59.86,52.4 61.38,50.87 v61.38,48.59 | v49.95,37.41 49.95,33.35 44.11,27.5 44.11,25.73 43.09,24.71 35.98,24.71 33.44,27.25 v33.44,29.03 | v27.34,40.2 27.34,41.73 29.38,43.76 v30.14,43.76
  Bottom 0.254: U$18.44 36.45,29.03 v33.44,29.03 33.19,29.03 32.17,30.04 32.17,41.73 v30.14,43.76 | v27.34,40.2 25.48,40.2 R8.1 | v61.38,48.59 61.38,44.27 57.06,39.95 53.76,39.95 51.22,37.41 v49.95,37.41 | v67.73,69.16 73.03,69.16 U$27.1
RST  (via drill 0.5)
  Top 0.254: v47.66,36.14 44.11,39.7 v44.11,42.74 | v46.65,48.33 46.65,49.09 42.84,52.9 v42.84,53.67 | v33.19,44.78 33.19,45.54 25.82,52.9 25.82,63.32 v25.49,63.57 | v14.64,64.33 14.14,64.84 14.14,71.95 v13.88,72.21 13.88,73.73 14.9,74.75 16.17,74.75 19.47,78.05 19.47,81.86 20.49,82.88 22.07,82.88 U$6.1
  Bottom 0.254: U$18.23 46.96,36.14 v47.66,36.14 | v44.11,42.74 44.11,44.52 46.65,47.06 v46.65,48.33 | v42.84,53.67 42.84,52.9 42.33,52.4 33.19,52.4 32.42,51.63 32.42,45.54 v33.19,44.78 | v25.49,63.57 15.41,63.57 v14.64,64.33
  Bottom 0.406: R5.1 3.64,71.57 RST.1
  Bottom 0.508: R5.1 8.8,71.57 9.44,72.21 v13.88,72.21
SCLK  (via drill 0.5)
  Top 0.254: 36.74,56.69 U$26.P$9 36.78,58.71 35.98,59.51 35.98,62.81 37,63.83 39.03,63.83 43.85,59 43.85,52.9 48.43,48.33 51.47,48.33 51.98,47.82 51.98,33.09 48.68,29.79 48.68,28.95 v48.93,28.7
  Bottom 0.254: U$18.28 47.36,28.77 48.86,28.77 v48.93,28.7
SWDCLK  (via drill 0.5)
  Top 0.254: v71.54,60.27 70.78,60.27 69.25,58.75 v69.25,56.97 | v55.28,67.13 v51.73,67.13 | v26.33,77.03 25.82,76.53 25.82,72.46 23.79,70.43 23.79,55.44 v24.04,55.19 | U$6.2 22.01,81.57 20.95,81.57 20.23,80.84 20.23,78.05 v20.49,77.8
  Bottom 0.254: v71.54,60.27 72.48,61.21 R2.2 | 56.81,53.16 56.81,65.86 55.54,67.13 v55.28,67.13 | 56.81,53.16 56.81,45.79 48.93,37.92 48.93,35.89 48.17,35.12 46.51,35.12 U$18.24 | v69.25,56.97 69.25,55.44 67.48,53.67 57.32,53.67 56.81,53.16 | v51.73,67.13 39.79,67.13 32.17,59.51 28.36,59.51 v24.04,55.19 | v26.33,77.03 21.25,77.03 v20.49,77.8
TFT  (via drill 0.5)
  Top 0.254: 38.77,60.02 38.77,59.25 39.17,58.86 U$26.P$6 39.17,53.78 39.54,53.41 v39.54,50.62
  Top 0.406: 38.77,60.02 38.87,60.02 R17.2
  Bottom 0.254: U$18.3 35.22,37.53 35.22,48.59 36.49,49.86 38.77,49.86 v39.54,50.62

### Text on the board
Top: TOP
Bottom: www.bibox.in | BITRBKV-2
tNames: B4 | B3 | B2 | B1